# Altium project Digital Interface.PrjPcb (part 1 of 2)
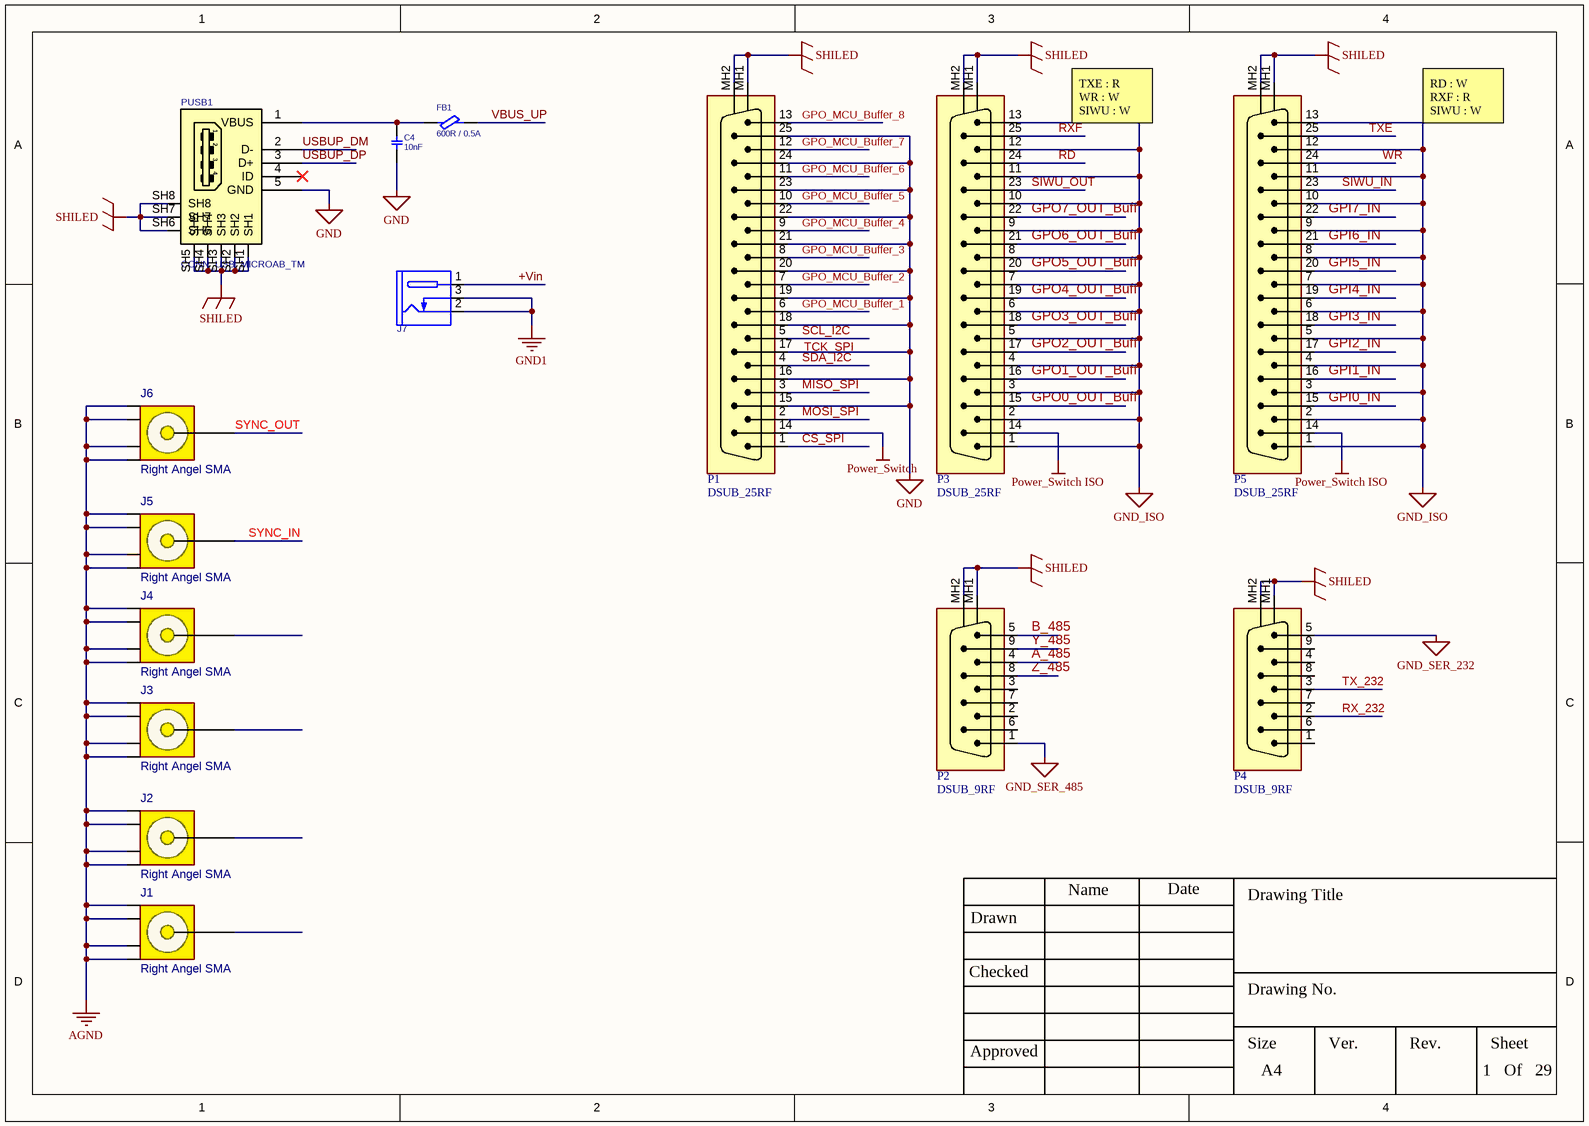
[diagram p0: Terminals.SchDoc]
29 sheets, 393 parts. Net scope: global (net labels, ports and power ports of the same name join across sheets).
Board file: PCB_V0.0.PcbDoc
Sheets:
  Terminals.SchDoc
  Main Power.SchDoc
  AUX Power.SchDoc
  MCU 1.SchDoc
  Analog input.SchDoc
  Analog Output.SchDoc
  USB HUB.SchDoc
  BIT(Built in Test).SchDoc
  Test Points.SchDoc
  RS232.SchDoc
  RS485.SchDoc
  Power Switch.SchDoc
  Display .SchDoc
  Buffers.SchDoc
  Mode Switch.SchDoc
  Level Shifting.SchDoc
  Isolators.SchDoc
  Audio Codec.SchDoc
  SD CARD .SchDoc
  MCU GPIO.SchDoc
  MCU Sup.SchDoc
  Sync In.SchDoc
  Sync Out.SchDoc
  Iso Power Protection.SchDoc
  FT2232HL_IN.SchDoc
  FT2232HL_OUT.SchDoc
  USB_TTL.SchDoc
  On Board Terminals.SchDoc
  screw and Hole.SchDoc

## Sheet Terminals.SchDoc
size 297 x 209 mm; SheetNumber: 1; SheetTotal: 29

### Parts
C4  10nF  [C0603]
FB1  600R / 0.5A  [L0603]
J1  Right Angel SMA  [SMA_RA]
J2  Right Angel SMA  [SMA_RA]
J3  Right Angel SMA  [SMA_RA]
J4  Right Angel SMA  [SMA_RA]
J5  Right Angel SMA  [SMA_RA]
J6  Right Angel SMA  [SMA_RA]
J7  DC_POWER_JACK  [JAC_PWR2]  (value not drawn)
P1  DSUB_25RF  [DSUB_25RF]
P2  DSUB_9RF  [DSUB_9RF]
P3  DSUB_25RF  [DSUB_25RF]
P4  DSUB_9RF  [DSUB_9RF]
P5  DSUB_25RF  [DSUB_25RF]
PUSB1  CONN_USB_MICROAB_TM  [USB_MICRO_AB_TM_SHT]

### Nets
AGND: J1.2(G1) J1.3(G2) J1.4(G3) J1.5(G4) J2.2(G1) J2.3(G2) J2.4(G3) J2.5(G4) J3.2(G1) J3.3(G2) J3.4(G3) J3.5(G4) J4.2(G1) J4.3(G2) J4.4(G3) J4.5(G4) J5.2(G1) J5.3(G2) J5.4(G3) J5.5(G4) J6.2(G1) J6.3(G2) J6.4(G3) J6.5(G4)
GND: C4.1 P1.15 P1.16 P1.17 P1.18 P1.19 P1.20 P1.21 P1.22 P1.23 P1.24 P1.25 PUSB1.5(GND)
GND1: J7.2(SLEEVE) J7.3(INSERTION_DET)
GND_ISO: P3.1 P3.2 P3.3 P3.4 P3.5 P3.6 P3.7 P3.8 P3.9 P3.10 P3.11 P3.12 P3.13 P5.1 P5.2 P5.3 P5.4 P5.5 P5.6 P5.7 P5.8 P5.9 P5.10 P5.11 P5.12 P5.13
GND_SER_232: P4.5
GND_SER_485: P2.1
Power_Switch: P1.14
Power_Switch ISO: P3.14 P5.14
SHILED: P1.MH1 P1.MH2 P2.MH1 P2.MH2 P3.MH1 P3.MH2 P4.MH1 P4.MH2 P5.MH1 P5.MH2 PUSB1.SH1 PUSB1.SH2 PUSB1.SH3 PUSB1.SH4 PUSB1.SH5 PUSB1.SH6 PUSB1.SH7 PUSB1.SH8
+Vin: J7.1(TIP)
A_485: P2.4
B_485: P2.5
CS_SPI: P1.1
GPI0_IN: P5.15
GPI1_IN: P5.16
GPI2_IN: P5.17
GPI3_IN: P5.18
GPI4_IN: P5.19
GPI5_IN: P5.20
GPI6_IN: P5.21
GPI7_IN: P5.22
GPO0_OUT_Buff: P3.15
GPO1_OUT_Buff: P3.16
GPO2_OUT_Buff: P3.17
GPO3_OUT_Buff: P3.18
GPO4_OUT_Buff: P3.19
GPO5_OUT_Buff: P3.20
GPO6_OUT_Buff: P3.21
GPO7_OUT_Buff: P3.22
GPO_MCU_Buffer_1: P1.6
GPO_MCU_Buffer_2: P1.7
GPO_MCU_Buffer_3: P1.8
GPO_MCU_Buffer_4: P1.9
GPO_MCU_Buffer_5: P1.10
GPO_MCU_Buffer_6: P1.11
GPO_MCU_Buffer_7: P1.12
GPO_MCU_Buffer_8: P1.13
MISO_SPI: P1.3
MOSI_SPI: P1.2
~{RD}: P3.24
~{RXF}: P3.25
RX_232: P4.2
SCL_I2C: P1.5  [also labelled TCK_SPI]
SDA_I2C: P1.4
SIWU_IN: P5.23
SIWU_OUT: P3.23
SYNC_IN: J5.1(SIG)  [project net 50_OHM]
SYNC_OUT: J6.1(SIG)
~{TXE}: P5.25
TX_232: P4.3
USBUP_DM: PUSB1.2(D-)
USBUP_DP: PUSB1.3(D+)
VBUS_UP: FB1.2
~{WR}: P5.24
Y_485: P2.9
Z_485: P2.8
NetC4_2: C4.2 FB1.1 PUSB1.1(VBUS)

Not connected (* = marked no-connect by the designer): J1 1(SIG); J2 1(SIG); J3 1(SIG); J4 1(SIG); P2 2 3 6 7; P4 1 4 6 7 8 9; PUSB1 4(ID)*

### Notes on the sheet
- TXE : R
  WR : W
  SIWU : W
- RD : W
  RXF : R
  SIWU : W
- Drawn
- Name
- Date
- Drawing Title
- Checked
- Drawing No.
- Approved
- Size
- A4
- Ver.
- Rev.
- Sheet
- Of

### Library data of the parts
C4 = CAP_SMD_MLCC_10u16V: CAP, MLCC, X5R, 10uF, 10%, 16V, 0603; MANF_P#: GRT188R61C106KE13D; MANF: Murata; PARAM: X5R, 10%, -55~85°C; PARAM2: 16V; PRICE: 100= 20$; VALUE: 10nF
FB1 = FBEAD_SMD_MPZ1608S102: FERRITE_Bead, 0603, 0.8A, 300mOhm, 1000@100MHz; MANF: TDK; MANF_P#: MPZ1608S102ATA00; PARAM: 1000@100MHz; PARAM2: 0.8A; PRICE: 100= 3.4$; VALUE: 600R / 0.5A
J1-J6 = CONN_RF_SMA_RA: CONN, RF, SMA, Right Angle; MANF_P#: SMA-J-P-H-RA-TH1; MANF: Samtec; PARAM: 50Ohm, 20GHz; DESC: DESCRIPTION; DIST#: DIGIKEY; PARAM2: GOLD; ASSEMBLY: ASSEMBLY; PRICE: 6.3$; VALUE: Right Angel SMA
J7 = CONN_PWR_JACKR2: CONN, PWR JACK DC, PLUG DIAM 2.0MM RA THD; MANF: CUI STACK; MANF_P#: PJ-202A, PJ-002AH, PJ-102AH, KLDX-0202; VALUE: DC_POWER_JACK
P1 P3 P5 = CONN_DSUB_25RF: CONN, DSUB, HD, 25PIN, R/A, FEMALE, THD; MANF_P#: -; MANF: -; VALUE: DSUB_25RF
P2 P4 = CONN_DSUB_9RF: CONN, DSUB, HD, 9PIN, R/A, FEMALE, THD; MANF_P#: -; MANF: -; VALUE: DSUB_9RF
PUSB1 = CONN_USB_MICRO_AB_TM_SHT: CONN, USB, MICRO AB, R/A, SMD, TOP MOUNT; MANF_P#: 47590-0001; MANF: MOLEX; PARAM2: 30VAC; PARAM: 1.8A, -20~85oC; PRICE: 0.75$; VALUE: CONN_USB_MICROAB_TM

## Sheet Main Power.SchDoc
size 297 x 209 mm; SheetNumber: 2; SheetTotal: 29
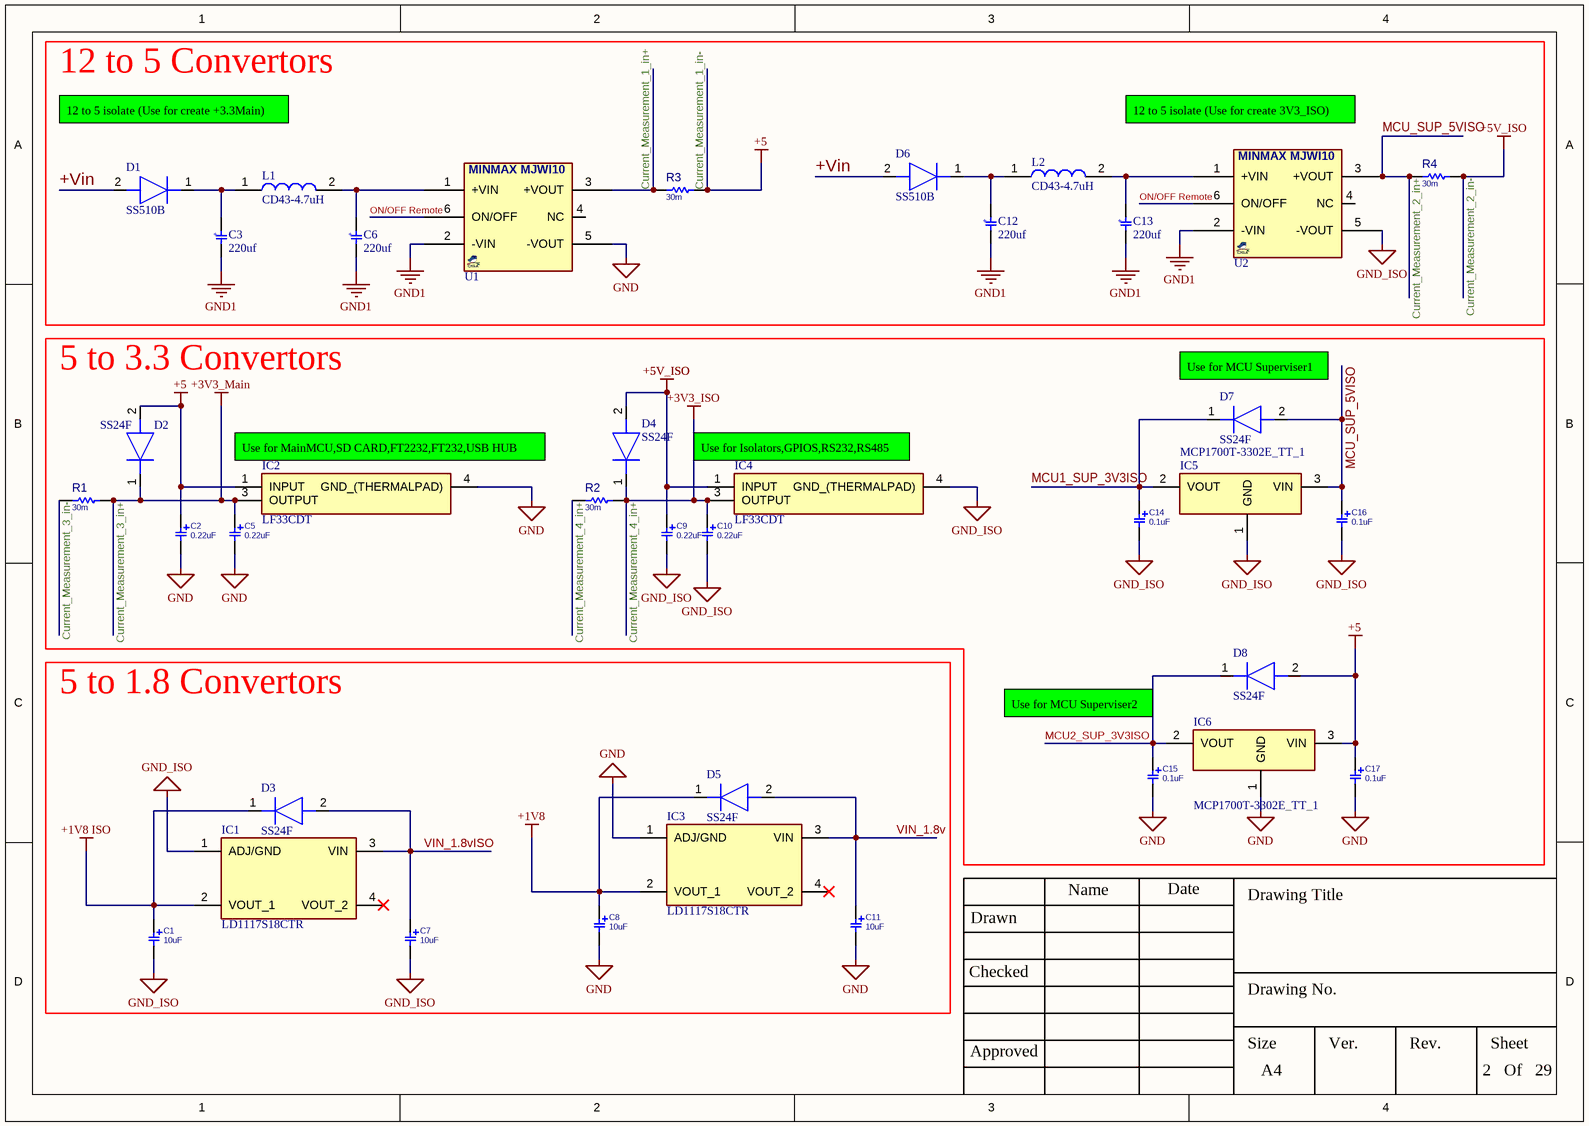
[diagram p1: Main Power.SchDoc]

### Parts
C1  10uF  [C_TN_3528]
C2  0.22uF  [C_TN_3528]
C3  value 220uf  [Cap_D]  (hidden comment: Capacitor Tantalum SMD)
C5  0.22uF  [C_TN_3528]
C6  value 220uf  [Cap_D]  (hidden comment: Capacitor Tantalum SMD)
C7  10uF  [C_TN_3528]
C8  10uF  [C_TN_3528]
C9  0.22uF  [C_TN_3528]
C10  0.22uF  [C_TN_3528]
C11  10uF  [C_TN_3528]
C12  value 220uf  [Cap_D]  (hidden comment: Capacitor Tantalum SMD)
C13  value 220uf  [Cap_D]  (hidden comment: Capacitor Tantalum SMD)
C14  0.1uF  [C_TN_3528]
C15  0.1uF  [C_TN_3528]
C16  0.1uF  [C_TN_3528]
C17  0.1uF  [C_TN_3528]
D1  SS510B  [DIOM5336X244N]
D2  SS24F  [SODFL4626X110N]
D3  SS24F  [SODFL4626X110N]
D4  SS24F  [SODFL4626X110N]
D5  SS24F  [SODFL4626X110N]
D6  SS510B  [DIOM5336X244N]
D7  SS24F  [SODFL4626X110N]
D8  SS24F  [SODFL4626X110N]
IC1  LD1117S18CTR  [SOT230P700X180-4N]
IC2  LF33CDT  [TO228P972X240-3N]
IC3  LD1117S18CTR  [SOT230P700X180-4N]
IC4  LF33CDT  [TO228P972X240-3N]
IC5  MCP1700T-3302E_TT_1  [SOT95P237X112-3N]
IC6  MCP1700T-3302E_TT_1  [SOT95P237X112-3N]
L1  CD43-4.7uH  [CD43NP220MC]
L2  CD43-4.7uH  [CD43NP220MC]
R1  30m  [R2512]
R2  30m  [R2512]
R3  30m  [R2512]
R4  30m  [R2512]
U1  MJWI10-24S05  [MINMAX_MJWI10]  (value not drawn)
U2  MJWI10-24S05  [MINMAX_MJWI10]  (value not drawn)

### Blocks framed on the sheet
12 to 5 Convertors: C3 C6 C12 C13 D1 D6 L1 L2 R3 R4 U1 U2
5 to 3.3 Convertors: C2 C5 C9 C10 C14-C17 D2 D4 D7 D8 IC2 IC4-IC6 R1 R2
5 to 1.8 Convertors: C1 C7 C8 C11 D3 D5 IC1 IC3

### Nets
+1V8: C8.1 D5.1(K) IC3.2(VOUT_1)  [project net Audio_VDD_1V8]
+1V8 ISO: C1.1 D3.1(K) IC1.2(VOUT_1)
+3V3_Main: C5.1 D2.1(K) IC2.3(OUTPUT) R1.2  [also labelled Current_Measurement_3_in+]  [project net Audio_VDD_3V3]
Current_Measurement_1_in-: C2.1 C17.1 D2.2(A) D8.2(A) IC2.1(INPUT) IC6.3(VIN) R3.2  [also labelled +5]
Current_Measurement_2_in-: C9.1 D4.2(A) IC4.1(INPUT) R4.2  [also labelled +5V_ISO]
Current_Measurement_4_in+: C10.1 D4.1(K) IC4.3(OUTPUT) R2.1 R2.2  [also labelled +3V3_ISO]
GND: C2.2 C5.2 C8.2 C11.2 C15.2 C17.2 IC2.4(GND_(THERMALPAD)) IC3.1(ADJ/GND) IC6.1(GND) U1.5(-VOUT)
GND1: C3.1 C6.1 C12.1 C13.1 U1.2(-VIN) U2.2(-VIN)
GND_ISO: C1.2 C7.2 C9.2 C10.2 C14.2 C16.2 IC1.1(ADJ/GND) IC4.4(GND_(THERMALPAD)) IC5.1(GND) U2.5(-VOUT)
MCU2_SUP_3V3ISO: C15.1 D8.1(K) IC6.2(VOUT)
+Vin: D1.2(A) D6.2(A)
Current_Measurement_1_in+: R3.1 U1.3(+VOUT)
Current_Measurement_2_in+: C16.1 D7.2(A) IC5.3(VIN) R4.1 U2.3(+VOUT)  [also labelled MCU_SUP_5VISO]
Current_Measurement_3_in-: R1.1
MCU1_SUP_3V3ISO: C14.1 D7.1(K) IC5.2(VOUT)
ON/OFF Remote: U1.6(ON/OFF) U2.6(ON/OFF)
VIN_1.8v: C11.1 D5.2(A) IC3.3(VIN)
VIN_1.8vISO: C7.1 D3.2(A) IC1.3(VIN)
NetC3_2: C3.2 D1.1(K) L1.1
NetC6_2: C6.2 L1.2 U1.1(+VIN)
NetC12_2: C12.2 D6.1(K) L2.1
NetC13_2: C13.2 L2.2 U2.1(+VIN)

Not connected (* = marked no-connect by the designer): IC1 4(VOUT_2)*; IC3 4(VOUT_2)*; U1 4(NC); U2 4(NC)

### Notes on the sheet
- 12 to 5 isolate (Use for create +3.3Main)
- 12 to 5 isolate (Use for create 3V3_ISO)
- (near D7) Use for MCU Superviser1
- (near IC2) Use for MainMCU,SD CARD,FT2232,FT232,USB HUB
- (near IC4) Use for Isolators,GPIOS,RS232,RS485
- Use for MCU Superviser2
- Drawn
- Name
- Date
- Drawing Title
- Checked
- Drawing No.
- Approved
- Size
- A4
- Ver.
- Rev.
- Sheet
- Of
- (in symbol Capacitor Tantalum SMD) +
- (in symbol MJWI10-24S05) MINMAX MJWI10

### Library data of the parts
C1 C2 C5 C7-C11 C14-C17 = CAP_SMD_TAN: CAP, SMD, TAN,; PARAM2: -V
  C1 C7 C8 C11: VALUE: 10uF
  C2 C5 C9 C10: VALUE: 0.22uF
  C14-C17: VALUE: 0.1uF
D1 D6 = SS510B: Diode; Manufacturer_Name: HY Electronic; Height: 2.44mm; Manufacturer_Part_Number: SS510B
D2-D5 D7 D8 = SS24F: Diode; Manufacturer_Name: Shikues; Datasheet Link: https://eastronic88.en.made-in-china.com/print/FZStilOdyghn/China-Schottky-Barrier-Rectifier-Diode-SS24F-2-0A-40V-SMAF.html; Height: 1.1mm; Manufacturer_Part_Number: SS24F
IC1 IC3 = LD1117S18CTR: Integrated Circuit; Manufacturer_Name: STMicroelectronics; Datasheet Link: http://www.st.com/st-web-ui/static/active/en/resource/technical/document/datasheet/CD00000544.pdf; Height: 1.8mm; Manufacturer_Part_Number: LD1117S18CTR; Mouser Part Number: 511-LD1117S18CTR; Mouser Price/Stock: https://www.mouser.co.uk/ProductDetail/STMicroelectronics/LD1117S18CTR?qs=qolwYojYp3Sa3BPkKnJupg%3D%3D; Arrow Part Number: LD1117S18CTR; Arrow Price/Stock: https://www.arrow.com/en/products/ld1117s18ctr/stmicroelectronics?region=nac
IC2 IC4 = LF33CDT: Integrated Circuit; Manufacturer_Name: STMicroelectronics; Datasheet Link: http://www.st.com/web/en/resource/technical/document/datasheet/CD00000546.pdf; Height: 2.4mm; Manufacturer_Part_Number: LF33CDT; Mouser Part Number: 511-LF33CDT; Mouser Price/Stock: https://www.mouser.co.uk/ProductDetail/STMicroelectronics/LF33CDT?qs=tZUCD5p2VWo1sRQNOfAbrg%3D%3D
IC5 IC6 = MCP1700T-3302E_TT_1: Integrated Circuit; Manufacturer_Name: Microchip; Manufacturer_Part_Number: MCP1700T-3302E/TT; Datasheet Link: https://datasheet.datasheetarchive.com/originals/distributors/SFDatasheet-4/sf-00090030.pdf; Height: 1.12mm; Mouser Part Number: 579-MCP1700T3302E/TT; Mouser Price/Stock: https://www.mouser.co.uk/ProductDetail/Microchip-Technology/MCP1700T-3302E-TT?qs=fM4xO01eazPmCNDrdHEdaw%3D%3D; Arrow Part Number: MCP1700T-3302E/TT; Arrow Price/Stock: https://www.arrow.com/en/products/mcp1700t-3302ett/microchip-technology?region=europe
L1 L2 = CD43NP-220MC: Inductor; Manufacturer_Name: Sumida; Datasheet Link: https://products.sumida.com/products/pdf/CD43.pdf; Height: 3.5mm; Manufacturer_Part_Number: CD43NP-220MC; Mouser Part Number: 851-CD43NP-220MC; Mouser Price/Stock: https://www.mouser.co.uk/ProductDetail/Sumida/CD43NP-220MC?qs=ttApTud31JYLH5yY3TuJPg%3D%3D; Arrow Part Number: CD43NP-220MC; Arrow Price/Stock: https://www.arrow.com/en/products/cd43np-220mc/sumida?region=nac
R1-R4 = RES_SMD_2512: RESISTOR, SMD; PARAM: -W; DESC: DESCRIPTION; DIST#: MOUSER; PARAM2: 1%; MANF_P#: -; MANF: -; ASSEMBLY: ASSEMBLY; PRICE: 100= 0.5$; VALUE: 30m
U1 U2 = MJWI10-24S05: DC-DC Converter, Isolated, 10W; MANF: MINMAX; PARAM2: 9~36(24)Vin, 5Vout, 10W; PARAM: 2000mA, -40~80°C; DESC: https://www.minmax.com.tw/en/download/files/546/MJWI10_Datasheet.pdf; MANF_P#: MJWI10-24S05; VALUE: MJWI10-24S05
C3 C6 C12 C13 = Capacitor Tantalum SMD: DatasheetVersion: 2021; ComponentLink1Description: Website Smart World; ComponentLink1URL: https://www.smartw.ir/; ComponentLink2Description: Telegram; ComponentLink2URL: https://t.me/altium_smartw; ComponentLink3Description: Instagram; ComponentLink3URL: https://Instagram.com/smartgw.ir

## Sheet AUX Power.SchDoc
size 297 x 209 mm; SheetNumber: 3; SheetTotal: 29
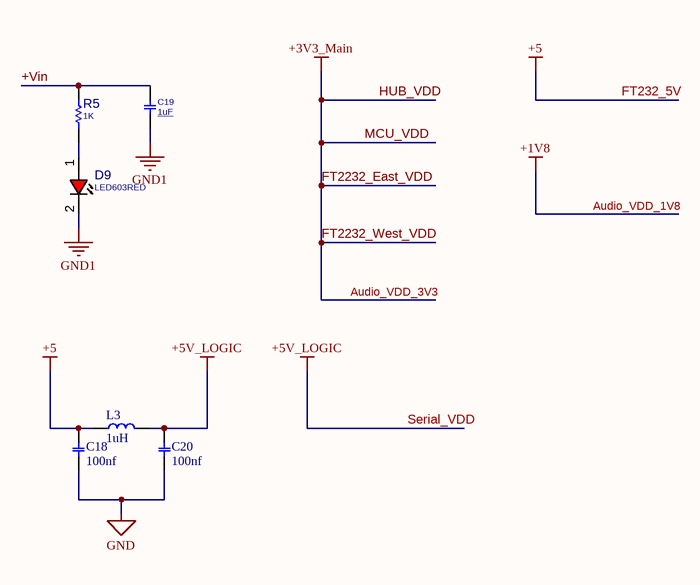
[diagram p2: AUX Power.SchDoc]

### Parts
C18  value 100nf  [C1206]  (hidden comment: Capacitor C SMD 1206)
C19  1uF  [0603]
C20  value 100nf  [C1206]  (hidden comment: Capacitor C SMD 1206)
D9  LED603RED  [LED0603RED]
L3  value 1uH  [L1812]  (hidden comment: Inductor SMD NC 1812)
R5  1K  [R0603]

### Nets
+5: C18.2 L3.1  [also labelled FT232_5V]  [project net Current_Measurement_1_in-]
GND: C18.1 C20.1
GND1: C19.2 D9.2(CATHODE)
Serial_VDD: C20.2 L3.2  [also labelled +5V_LOGIC]
+Vin: C19.1 R5.2
NetD9_1: D9.1(ANODE) R5.1

### Notes on the sheet
- Drawn
- Name
- Date
- Drawing Title
- Checked
- Drawing No.
- Approved
- Size
- A4
- Ver.
- Rev.
- Sheet
- Of

### Library data of the parts
C19 = CAP_SMD_FILM_1u16v_1210: CAP, FILM, 1uF, 16V, Acryl, 20%, 1210; PARAM: Acrylic, MetallizedStacked, 20%, -40~85oC; MANF_P#: ECP-U1C105MA5; MANF: Panasonic; PRICE: 100= 36$; DESC: -; PARAM2: 16V; ASSEMBLY: ASSEMBLY; VALUE: 1uF
D9 = LED_SMD_0603_RED: LED, SMD, 0603, RED; PARAM: 30mA, 640nm; DESC: DESCRIPTION; MANF_P#: MANF_PART#; PARAM2: 1.8~2.5V; MANF: MANF; ASSEMBLY: ASSEMBLY; PRICE: PRICE; VALUE: LED603RED
R5 = RES_SMD_0603: RESISTOR, SMD; PARAM: -W; DESC: DESCRIPTION; DIST#: MOUSER; PARAM2: 1%; MANF_P#: -; MANF: -; ASSEMBLY: ASSEMBLY; PRICE: 100= 0.5$; VALUE: 1K
C18 C20 = Capacitor C SMD 1206: DatasheetVersion: 2021; ComponentLink1Description: Website Smart World; ComponentLink1URL: https://www.smartw.ir/; ComponentLink2Description: Telegram; ComponentLink2URL: https://t.me/altium_smartw; ComponentLink3Description: Instagram; ComponentLink3URL: https://Instagram.com/smartgw.ir
L3 = Inductor SMD NC 1812: DatasheetVersion: 2021; ComponentLink1Description: Website Smart World; ComponentLink1URL: https://www.smartw.ir/; ComponentLink2Description: Telegram; ComponentLink2URL: https://t.me/altium_smartw; ComponentLink3Description: Instagram; ComponentLink3URL: https://Instagram.com/smartgw.ir

## Sheet MCU 1.SchDoc
size 297 x 209 mm; SheetNumber: 4; SheetTotal: 29
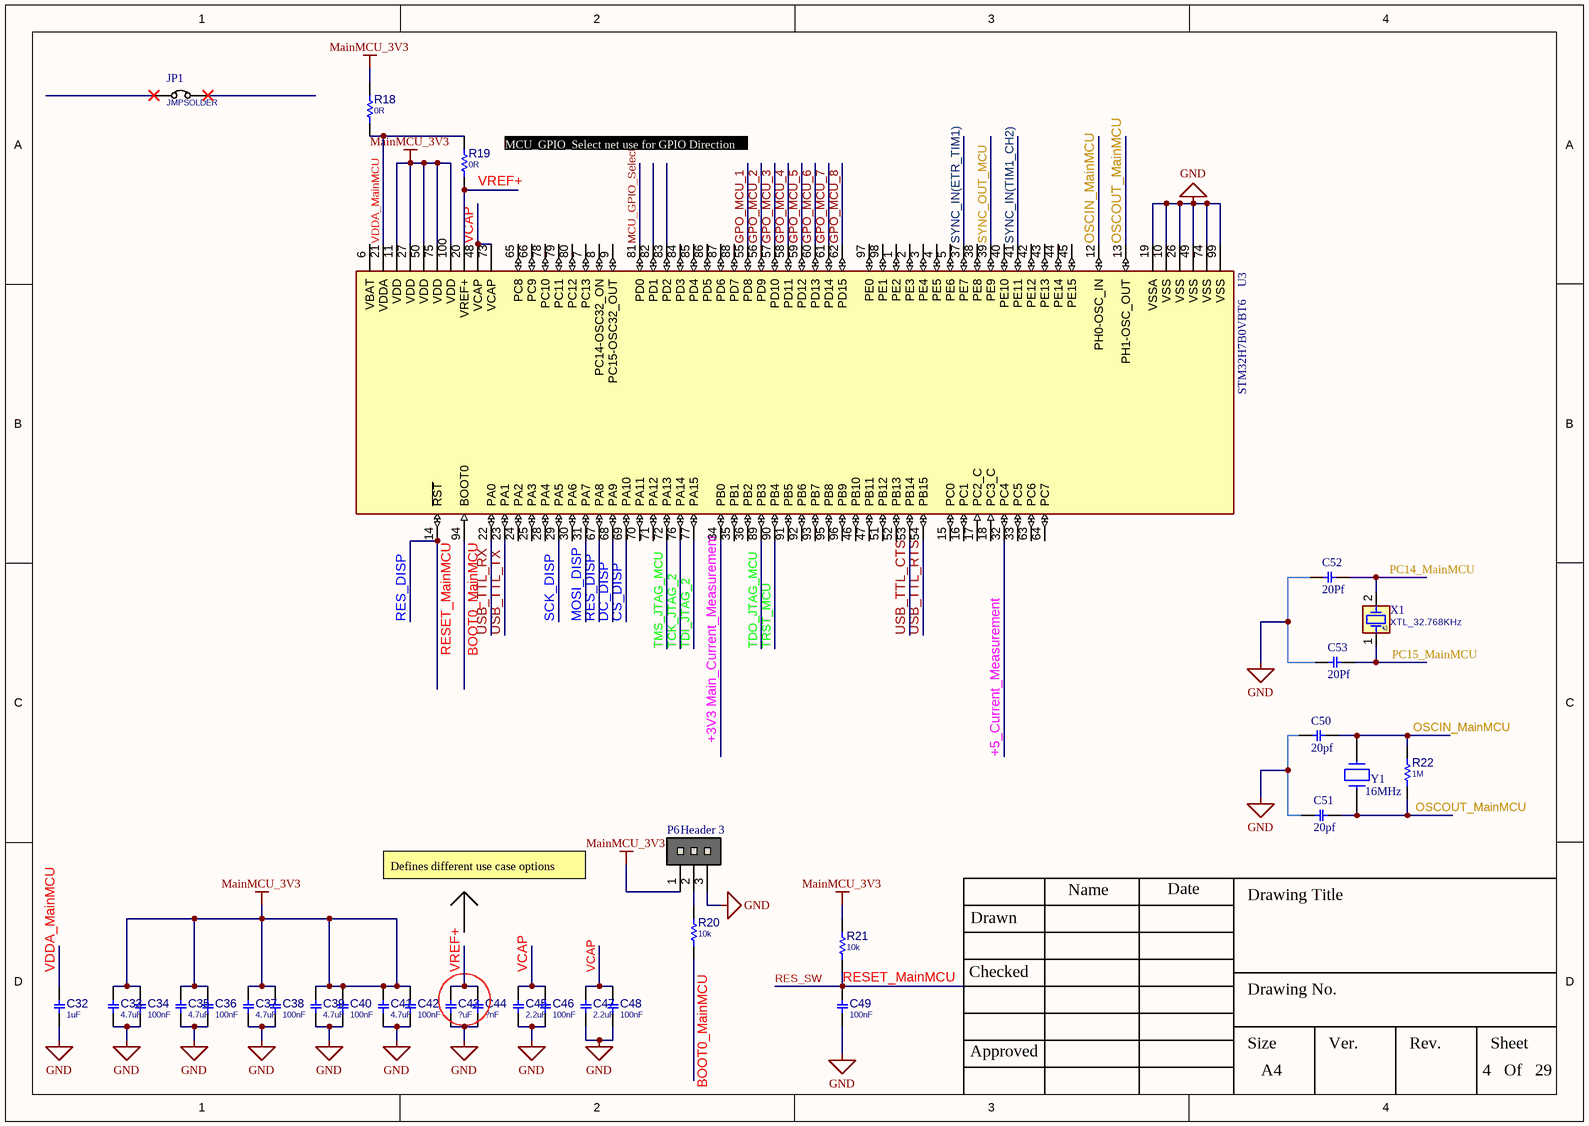
[diagram p3: MCU 1.SchDoc]

### Parts
C32  1uF  [C0805]
C33  4.7uF  [C0805]
C34  100nF  [C0603]
C35  4.7uF  [C0805]
C36  100nF  [C0603]
C37  4.7uF  [C0805]
C38  100nF  [C0603]
C39  4.7uF  [C0805]
C40  100nF  [C0603]
C41  4.7uF  [C0805]
C42  100nF  [C0603]
C43  ?uF  [C0805]
C44  ?nF  [C0603]
C45  2.2uF  [C0805]
C46  100nF  [C0603]
C47  2.2uF  [C0805]
C48  100nF  [C0603]
C49  100nF  [C0603]
C50  value 20pf  [C0603]  (hidden comment: Capacitor C SMD 0603)
C51  value 20pf  [C0603]  (hidden comment: Capacitor C SMD 0603)
C52  value 20Pf  [C0603]  (hidden comment: Capacitor C SMD 0603)
C53  value 20Pf  [C0603]  (hidden comment: Capacitor C SMD 0603)
JP1  JMPSOLDER  [JP_40X50]
P6  Header 3  [HDR 1X3]
R18  0R  [R0603]
R19  0R  [R0603]
R20  10k  [R0603]
R21  10k  [R0603]
R22  1M  [R0603]
U3  STM32H7B0VBT6  [QFP50P1600X1600X160-100N]
X1  XTL_32.768KHz  [XTL_2_2012]
Y1  16MHz  [XTL_2_11X5]

### Nets
GND: C32.2 C33.2 C34.2 C35.2 C36.2 C37.2 C38.2 C39.2 C40.2 C41.2 C42.2 C43.2 C44.2 C45.2 C46.2 C47.2 C48.2 C49.2 C50.1 C51.1 C52.1 C53.1 P6.3 U3.10(VSS) U3.19(VSSA) U3.26(VSS) U3.49(VSS) U3.74(VSS) U3.99(VSS)
MainMCU_3V3: C33.1 C34.1 C35.1 C36.1 C37.1 C38.1 C39.1 C40.1 C41.1 C42.1 P6.1 R18.2 R21.2 U3.11(VDD) U3.27(VDD) U3.50(VDD) U3.75(VDD) U3.100(VDD)
+3V3 Main_Current_Measurement: U3.34(PB0)
+5_Current_Measurement: U3.32(PC4)
BOOT0_MainMCU: R20.1 U3.94(BOOT0)
CS_DISP: U3.69(PA10)
DC_DISP: U3.68(PA9)
GPO_MCU_1: U3.55(PD8)
GPO_MCU_2: U3.56(PD9)
GPO_MCU_3: U3.57(PD10)
GPO_MCU_4: U3.58(PD11)
GPO_MCU_5: U3.59(PD12)
GPO_MCU_6: U3.60(PD13)
GPO_MCU_7: U3.61(PD14)
GPO_MCU_8: U3.62(PD15)
MCU_GPIO_Select: U3.81(PD0)
MOSI_DISP: U3.31(PA7)
OSCIN_MainMCU: C50.2 R22.2 U3.12(PH0-OSC_IN) Y1.2
OSCOUT_MainMCU: C51.2 R22.1 U3.13(PH1-OSC_OUT) Y1.1
PC14_MainMCU: C52.2 X1.2(OSC2)
PC15_MainMCU: C53.2 X1.1(OSC1)
RES_DISP: C49.1 R21.1 U3.14(~{RST}) U3.67(PA8)  [also labelled RES_SW, RESET_MainMCU]
SCK_DISP: U3.29(PA5)
SYNC_IN(ETR_TIM1): U3.37(PE7)
SYNC_IN(TIM1_CH2): U3.41(PE11)
SYNC_OUT_MCU: U3.39(PE9)
~{TRST}_MCU: U3.90(PB4)
TCK_JTAG_2: U3.76(PA14)
TDI_JTAG_2: U3.77(PA15)
TDO_JTAG_MCU: U3.89(PB3)
TMS_JTAG_MCU: U3.72(PA13)
USB_TTL_CTS: U3.53(PB14)
USB_TTL_RTS: U3.54(PB15)
USB_TTL_RX: U3.22(PA0)
USB_TTL_TX: U3.23(PA1)
VCAP: C45.1 C46.1 C47.1 C48.1 U3.48(VCAP) U3.73(VCAP)
VDDA_MainMCU: C32.1 R18.1 R19.2 U3.21(VDDA)
VREF+: C43.1 C44.1 R19.1 U3.20(VREF+)
NetP6_2: P6.2 R20.2

Not connected (* = marked no-connect by the designer): JP1 1* 2*; U3 1(PE2) 2(PE3) 3(PE4) 4(PE5) 5(PE6) 6(VBAT) 7(PC13) 8(PC14-OSC32_ON) 9(PC15-OSC32_OUT) 15(PC0) 16(PC1) 17(PC2_C) 18(PC3_C) 24(PA2) 25(PA3) 28(PA4) 30(PA6) 33(PC5) 35(PB1) 36(PB2) 38(PE8) 40(PE10) 42(PE12) 43(PE13) 44(PE14) 45(PE15) 46(PB10) 47(PB11) 51(PB12) 52(PB13) 63(PC6) 64(PC7) 65(PC8) 66(PC9) 70(PA11) 71(PA12) 78(PC10) 79(PC11) 80(PC12) 82(PD1) 83(PD2) 84(PD3) 85(PD4) 86(PD5) 87(PD6) 88(PD7) 91(PB5) 92(PB6) 93(PB7) 95(PB8) 96(PB9) 97(PE0) 98(PE1)

### Notes on the sheet
- (near R19) MCU_GPIO_Select net use for GPIO Direction
- Defines different use case options
- Drawn
- Name
- Date
- Drawing Title
- Checked
- Drawing No.
- Approved
- Size
- A4
- Ver.
- Rev.
- Sheet
- Of

### Library data of the parts
C32 C33 C35 C37 C39 C41 C43 C45 C47 = CAP_SMD_MLCC_2.2u50V_0805: CAP, MLCC; MANF_P#: UMK212ABJ225KG-T; MANF: Taiyo Yuden; PARAM: X5R, 10%; DIST#: MOUSER; PARAM2: 50V; ASSEMBLY: ASSEMBLY; PRICE: 100= 10$; DESC: CAP, MLCC
  C32: VALUE: 1uF
  C33 C35 C37 C39 C41: VALUE: 4.7uF
  C43: VALUE: ?uF
  C45 C47: VALUE: 2.2uF
C34 C36 C38 C40 C42 C44 C46 C48 C49 = CAP_SMD_MLCC_2.2u50V_0603: CAP, MLCC; MANF_P#: C1005X7R1H104K050BB; MANF: TDK; PARAM: X7R, 10%; DIST#: MOUSER; PARAM2: 50V; ASSEMBLY: ASSEMBLY; PRICE: 1000= 27$; DESC: CAP, MLCC
  C34 C36 C38 C40 C42 C46 C48 C49: VALUE: 100nF
  C44: VALUE: ?nF
JP1 = JUMPER_SOLDER: JUMPER, HEADER 2PIN; MANF: MANF; MANF_P#: MANF_P#; VALUE: JMPSOLDER
P6 = Header 3: Header, 3-Pin; ComponentLinkp-URL: https://www.smartw.ir/; DatasheetVersion: 2020
R18-R21 = RES_SMD_0603: as R5 on sheet AUX Power; MANF_P#: -; MANF: -; ASSEMBLY: ASSEMBLY; PRICE: 100= 0.5$
  R18 R19: VALUE: 0R
  R20 R21: VALUE: 10k
R22 = RES_SMD: RESISTOR, SMD; PARAM: -W; DESC: DESCRIPTION; DIST#: MOUSER; PARAM2: 1%; MANF_P#: -; MANF: -; ASSEMBLY: ASSEMBLY; PRICE: 100= 0.5$; VALUE: 1M
U3 = STM32H7B0VBT6: ARMÂ® CortexÂ®-M7 STM32H7 Microcontroller IC 32-Bit Single-Core 280MHz 128KB (128K x 8) FLASH 100-LQFP (14x14); MF: STMicroelectronics; Availability: In Stock; Purchase-URL: https://pricing.snapeda.com/search/part/STM32H7B0VBT6/?ref=eda; SnapEDA_Link: https://www.snapeda.com/parts/STM32H7B0VBT6/STMicroelectronics/view-part/?ref=snap; MP: STM32H7B0VBT6; Price: None; Value: *; Check_prices: https://www.snapeda.com/parts/STM32H7B0VBT6/STMicroelectronics/view-part/?ref=eda; Package: LQFP-100 STMicroelectronics
X1 = XTL_2_32.768_2012EP: Crystal, 32.768KHz, 12pF, 20PPM; MANF: EPSON; MANF_P#: FC-12M 32.7680KA-A3; PARAM: -40~85oC; PARAM2: 12pF, 20PPM; PRICE: 0.8$; VALUE: XTL_32.768KHz
Y1 = Crystal: ComponentLink1Description: Website Smart World; ComponentLink1URL: https://www.smartw.ir/; ComponentLink2Description: Telegram; ComponentLink2URL: https://t.me/altium_smartw; ComponentLink3Description: Instagram; ComponentLink3URL: https://Instagram.com/smartgw.ir; DatasheetVersion: 2021
C50-C53 = Capacitor C SMD 0603: DatasheetVersion: 2021; ComponentLink1Description: Website Smart World; ComponentLink1URL: https://www.smartw.ir/; ComponentLink2Description: Telegram; ComponentLink2URL: https://t.me/altium_smartw; ComponentLink3Description: Instagram; ComponentLink3URL: https://Instagram.com/smartgw.ir

## Sheet Analog input.SchDoc
size 297 x 209 mm; SheetNumber: 6; SheetTotal: 32

### Notes on the sheet
- Drawn
- Name
- Date
- Drawing Title
- Checked
- Drawing No.
- Approved
- Size
- A4
- Ver.
- Rev.
- Sheet
- Of

## Sheet Analog Output.SchDoc
size 297 x 209 mm; SheetNumber: 7; SheetTotal: 32

### Notes on the sheet
- Drawn
- Name
- Date
- Drawing Title
- Checked
- Drawing No.
- Approved
- Size
- A4
- Ver.
- Rev.
- Sheet
- Of

## Sheet USB HUB.SchDoc
size 297 x 209 mm; SheetNumber: 7; SheetTotal: 29
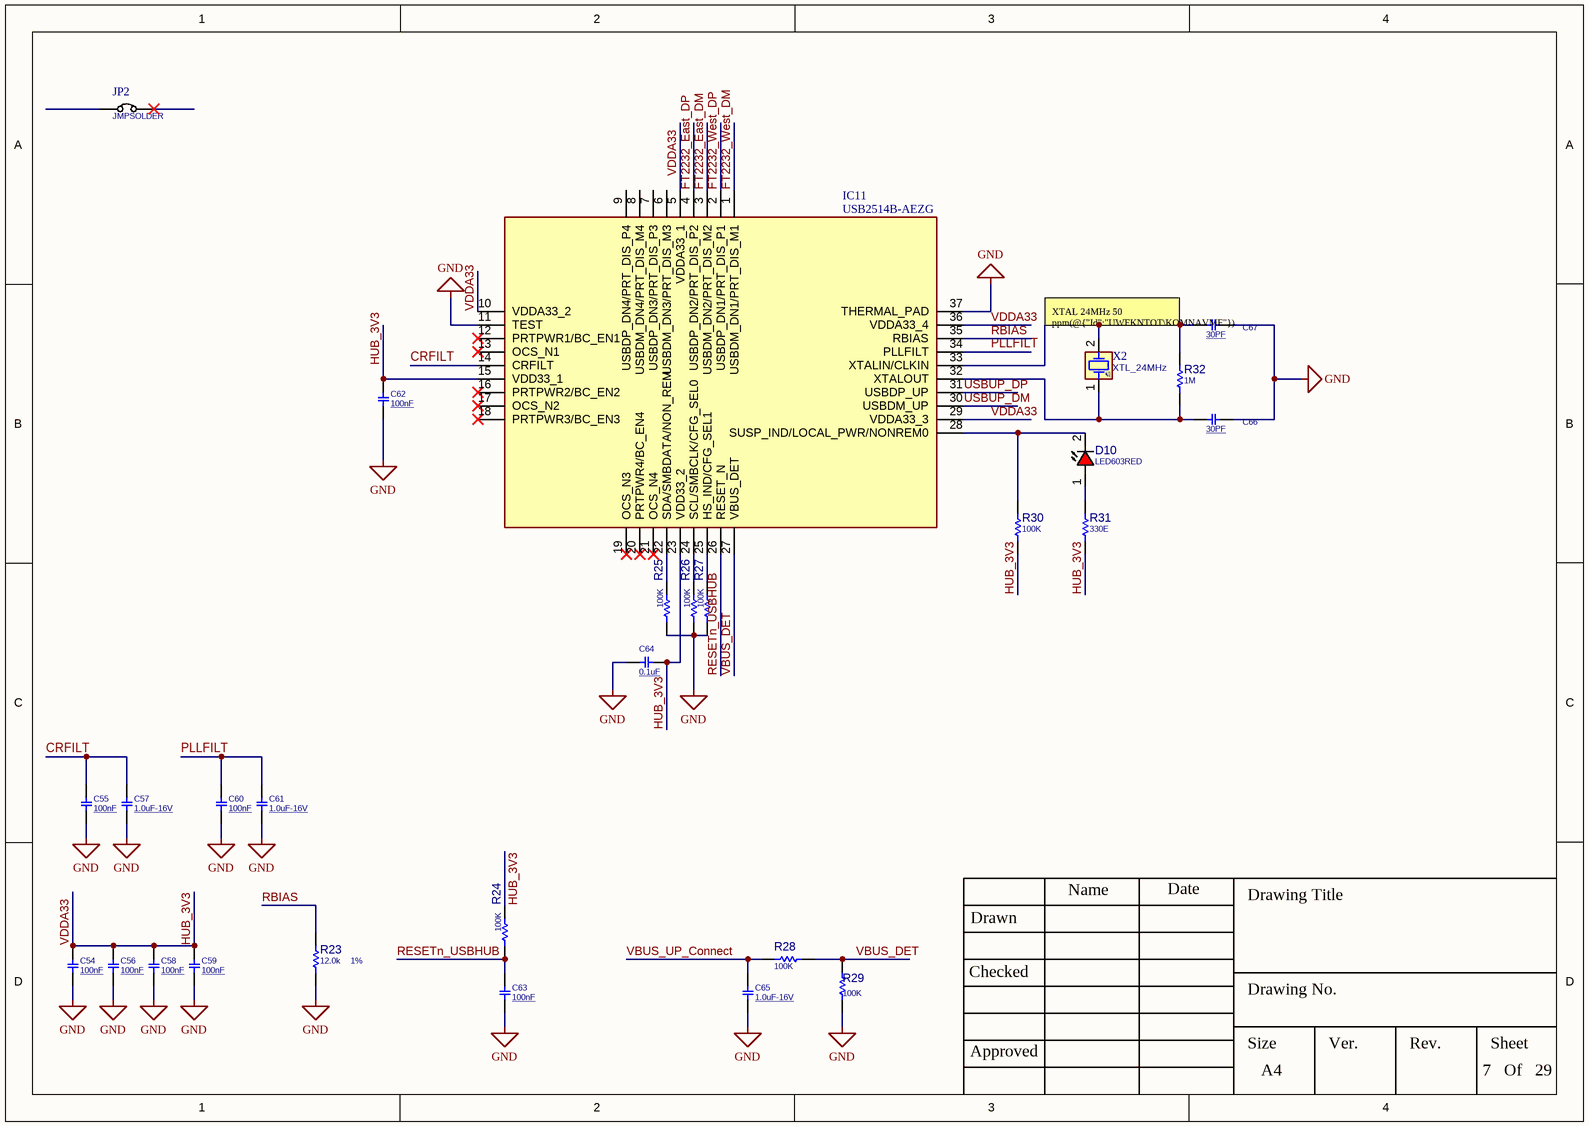
[diagram p4: USB HUB.SchDoc]

### Parts
C54  100nF  [0603]
C55  100nF  [0603]
C56  100nF  [0603]
C57  1.0uF-16V  [0603]
C58  100nF  [0603]
C59  100nF  [0603]
C60  100nF  [0603]
C61  1.0uF-16V  [0603]
C62  100nF  [0603]
C63  100nF  [0603]
C64  0.1uF  [0603]
C65  1.0uF-16V  [0603]
C66  30PF  [C0805]
C67  30PF  [C0805]
D10  LED603RED  [LED0603RED]
IC11  USB2514B-AEZG  [QFN50P600X600X100-37N-D]
JP2  JMPSOLDER  [JP_40X50]
R23  12.0k    1%  [R0603]
R24  100K  [R0603]
R25  100K  [R0603]
R26  100K  [R0603]
R27  100K  [R0603]
R28  100K  [R0603]
R29  100K  [R0603]
R30  100K  [R0603]
R31  330E  [R0603]
R32  1M  [R0603]
X2  XTL_24MHz  [XTL_2_11X5]

### Nets
GND: C54.1 C55.2 C56.1 C57.2 C58.1 C59.1 C60.2 C61.2 C62.1 C63.2 C64.2 C65.2 C66.2 C67.2 IC11.11(TEST) IC11.37(THERMAL_PAD) R23.1 R25.1 R26.1 R27.1 R29.1
CRFILT: C55.1 C57.1 IC11.14(CRFILT)
FT2232_East_DM: IC11.3(USBDM_DN2/PRT_DIS_M2)
FT2232_East_DP: IC11.4(USBDP_DN2/PRT_DIS_P2)
FT2232_West_DM: IC11.1(USBDM_DN1/PRT_DIS_M1)
FT2232_West_DP: IC11.2(USBDP_DN1/PRT_DIS_P1)
HUB_3V3: C54.2 C56.2 C58.2 C59.2 C62.2 C64.1 IC11.5(VDDA33_1) IC11.10(VDDA33_2) IC11.15(VDD33_1) IC11.23(VDD33_2) IC11.29(VDDA33_3) IC11.36(VDDA33_4) R24.2 R30.1 R31.1  [also labelled VDDA33]
PLLFILT: C60.1 C61.1 IC11.34(PLLFILT)
RBIAS: IC11.35(RBIAS) R23.2
RESETn_USBHUB: C63.1 IC11.26(RESET_N) R24.1
USBUP_DM: IC11.30(USBDM_UP)
USBUP_DP: IC11.31(USBDP_UP)
VBUS_DET: IC11.27(VBUS_DET) R28.2 R29.2
VBUS_UP_Connect: C65.1 R28.1
NetC66_1: C66.1 IC11.32(XTALOUT) R32.1 X2.1(OSC1)
NetC67_1: C67.1 IC11.33(XTALIN/CLKIN) R32.2 X2.2(OSC2)
NetD10_1: D10.1(ANODE) R31.2
NetD10_2: D10.2(CATHODE) IC11.28(SUSP_IND/LOCAL_PWR/NONREM0) R30.2
NetIC11_22: IC11.22(SDA/SMBDATA/NON_REM) R25.2
NetIC11_24: IC11.24(SCL/SMBCLK/CFG_SEL0) R26.2
NetIC11_25: IC11.25(HS_IND/CFG_SEL1) R27.2

Not connected (* = marked no-connect by the designer): IC11 6(USBDM_DN3/PRT_DIS_M3) 7(USBDP_DN3/PRT_DIS_P3) 8(USBDM_DN4/PRT_DIS_M4) 9(USBDP_DN4/PRT_DIS_P4) 12(PRTPWR1/BC_EN1)* 13(OCS_N1)* 16(PRTPWR2/BC_EN2)* 17(OCS_N2)* 18(PRTPWR3/BC_EN3)* 19(OCS_N3)* 20(PRTPWR4/BC_EN4)* 21(OCS_N4)*; JP2 1 2*

### Notes on the sheet
- XTAL 24MHz 50 ppm(@{"Id":"UWFKNTOT\KOMNAVMF"})
- Drawn
- Name
- Date
- Drawing Title
- Checked
- Drawing No.
- Approved
- Size
- A4
- Ver.
- Rev.
- Sheet
- Of

### Library data of the parts
C54-C65 = CAP_SMD_FILM_1u16v_1210: as C19 on sheet AUX Power; PRICE: 100= 36$; DESC: -; PARAM2: 16V; ASSEMBLY: ASSEMBLY
  C54-C56 C58-C60 C62 C63: VALUE: 100nF
  C57 C61 C65: VALUE: 1.0uF-16V
  C64: VALUE: 0.1uF
C66 C67 = CAP_SMD_MLCC: CAP, MLCC, 1nF, 50V, C0G, 10%, 0402; MANF: Murata; PARAM: C0G, 10%; PRICE: 100= 1.4$; DESC: -; MANF_P#: -; PARAM2: 50V; ASSEMBLY: ASSEMBLY; VALUE: 30PF
D10 = LED_SMD_0603_RED: as D9 on sheet AUX Power; MANF: MANF; ASSEMBLY: ASSEMBLY; PRICE: PRICE; VALUE: LED603RED
IC11 = USB2514B-AEZG: Integrated Circuit; Manufacturer_Name: Microchip; Datasheet Link: http://ww1.microchip.com/downloads/en/DeviceDoc/00001692C.pdf; Height: 1mm; Manufacturer_Part_Number: USB2514B-AEZG; Mouser Part Number: 886-USB2514B-AEZG; Mouser Price/Stock: https://www.mouser.co.uk/ProductDetail/Microchip-Technology/USB2514B-AEZG?qs=ydWXD%252B8LvLCxuNqQPTEcVA%3D%3D; Arrow Part Number: USB2514B-AEZG; Arrow Price/Stock: https://www.arrow.com/en/products/usb2514b-aezg/microchip-technology?region=nac
JP2 = JUMPER_SOLDER: JUMPER, HEADER 2PIN; MANF: MANF; MANF_P#: MANF_P#; VALUE: JMPSOLDER
R23 = RES_SMD_0603: RESISTOR, SMD; PARAM: -W; DESC: DESCRIPTION; DIST#: MOUSER; MANF_P#: -; MANF: -; ASSEMBLY: ASSEMBLY; PRICE: 100= 0.5$; PARAM2: 1%; VALUE: 12.0k    1%
R24-R32 = RES_SMD_0603: as R5 on sheet AUX Power; MANF_P#: -; MANF: -; ASSEMBLY: ASSEMBLY; PRICE: 100= 0.5$
  R24-R30: VALUE: 100K
  R31: VALUE: 330E
  R32: VALUE: 1M
X2 = XTL_2_HC49_8MHz_SMD: Crystal MOST POPULAR ABL HC49 PACKAGE; MANF: ABRACON; MANF_P#: ABLS-8.000MHZ-B4-T; PARAM: 8MHz, 18pF, 30PPM, -20~70oC; PRICE: 0.3$; VALUE: XTL_24MHz

## Sheet BIT(Built in Test).SchDoc
size 297 x 209 mm; SheetNumber: 8; SheetTotal: 29
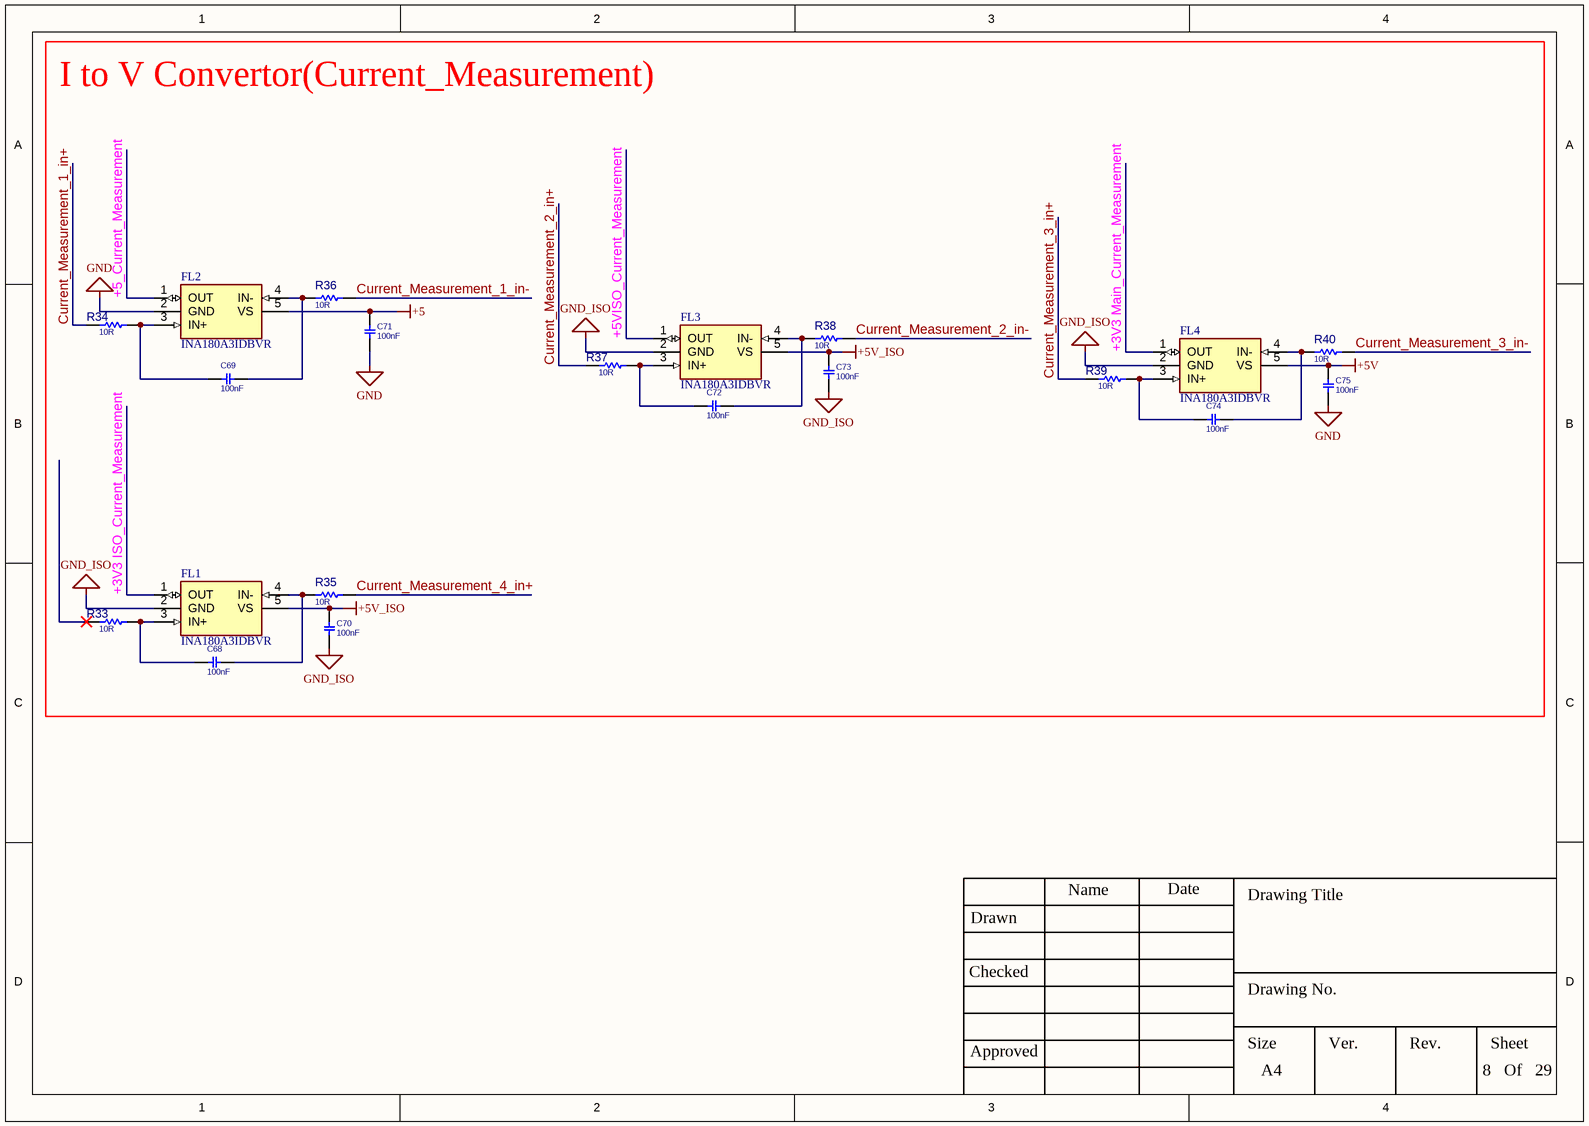
[diagram p5: BIT(Built in Test).SchDoc]

### Parts
C68  100nF  [C0603]
C69  100nF  [C0603]
C70  100nF  [C0603]
C71  100nF  [C0603]
C72  100nF  [C0603]
C73  100nF  [C0603]
C74  100nF  [C0603]
C75  100nF  [C0603]
FL1  INA180A3IDBVR  [SOT95P280X145-5N]
FL2  INA180A3IDBVR  [SOT95P280X145-5N]
FL3  INA180A3IDBVR  [SOT95P280X145-5N]
FL4  INA180A3IDBVR  [SOT95P280X145-5N]
R33  10R  [R2512]
R34  10R  [R2512]
R35  10R  [R2512]
R36  10R  [R2512]
R37  10R  [R2512]
R38  10R  [R2512]
R39  10R  [R2512]
R40  10R  [R2512]

### Blocks framed on the sheet
I to V Convertor(Current_Measurement): C68-C75 FL1-FL4 R33-R40

### Nets
+5V: C75.2 FL4.5(VS)
Current_Measurement_1_in-: C71.2 FL2.5(VS) R36.2  [also labelled +5]
Current_Measurement_2_in-: C70.2 C73.2 FL1.5(VS) FL3.5(VS) R38.2  [also labelled +5V_ISO]
Current_Measurement_3_in+: R39.1  [project net Audio_VDD_3V3]
Current_Measurement_4_in+: R35.2
GND: C71.1 C75.1 FL2.2(GND)
GND_ISO: C70.1 C73.1 FL1.2(GND) FL3.2(GND) FL4.2(GND)
+3V3 ISO_Current_Measurement: FL1.1(OUT)
+3V3 Main_Current_Measurement: FL4.1(OUT)
+5_Current_Measurement: FL2.1(OUT)
+5VISO_Current_Measurement: FL3.1(OUT)
Current_Measurement_1_in+: R34.1
Current_Measurement_2_in+: R37.1
Current_Measurement_3_in-: R40.2
NetC68_1: C68.1 FL1.4(IN-) R35.1
NetC68_2: C68.2 FL1.3(IN+) R33.2
NetC69_1: C69.1 FL2.4(IN-) R36.1
NetC69_2: C69.2 FL2.3(IN+) R34.2
NetC72_1: C72.1 FL3.4(IN-) R38.1
NetC72_2: C72.2 FL3.3(IN+) R37.2
NetC74_1: C74.1 FL4.4(IN-) R40.1
NetC74_2: C74.2 FL4.3(IN+) R39.2

Not connected (* = marked no-connect by the designer): R33 1*

### Notes on the sheet
- Drawn
- Name
- Date
- Drawing Title
- Checked
- Drawing No.
- Approved
- Size
- A4
- Ver.
- Rev.
- Sheet
- Of

### Library data of the parts
C68-C75 = CAP_SMD_MLCC_10u25V_0603: CAP, MLCC; MANF_P#: GRM188R61E106KA73; MANF: Murata; PARAM: X5R, 10%; PARAM2: 25V; PRICE: 100=15$; VALUE: 100nF
FL1-FL4 = INA180A3IDBVR: Filter; Manufacturer_Name: Texas Instruments; Datasheet Link: http://www.ti.com/lit/gpn/INA180; Height: 1.45mm; Manufacturer_Part_Number: INA180A3IDBVR; Mouser Part Number: 595-INA180A3IDBVR; Mouser Price/Stock: https://www.mouser.co.uk/ProductDetail/Texas-Instruments/INA180A3IDBVR?qs=5aG0NVq1C4xT61h4EgbaIA%3D%3D; Arrow Part Number: INA180A3IDBVR; Arrow Price/Stock: https://www.arrow.com/en/products/ina180a3idbvr/texas-instruments?region=nac
R33-R40 = RES_SMD_2512: as R1 on sheet Main Power; MANF_P#: -; MANF: -; ASSEMBLY: ASSEMBLY; PRICE: 100= 0.5$; VALUE: 10R

## Sheet Test Points.SchDoc
size 297 x 209 mm; SheetNumber: 9; SheetTotal: 29
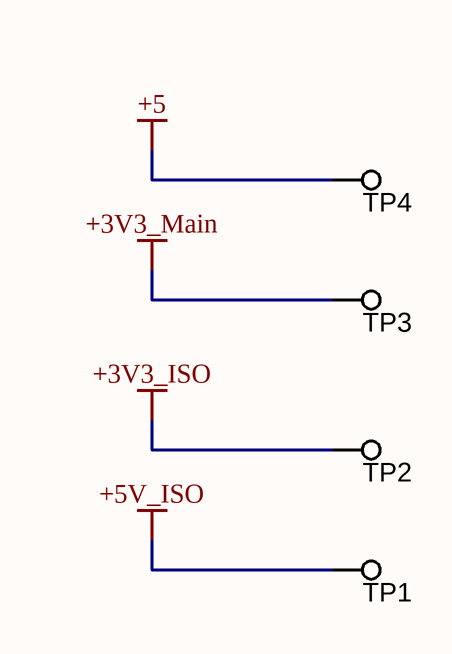
[diagram p6: Test Points.SchDoc]

### Parts
TP1  TESTPOINT_PROBE  [TP80D50]  (value not drawn)  (no BOM)
TP2  TESTPOINT_PROBE  [TP80D50]  (value not drawn)  (no BOM)
TP3  TESTPOINT_PROBE  [TP80D50]  (value not drawn)  (no BOM)
TP4  TESTPOINT_PROBE  [TP80D50]  (value not drawn)  (no BOM)

### Nets
+3V3_ISO: TP2.1  [project net Current_Measurement_4_in+]
+3V3_Main: TP3.1  [project net Audio_VDD_3V3]
+5: TP4.1  [project net Current_Measurement_1_in-]
+5V_ISO: TP1.1  [project net Current_Measurement_2_in-]

### Notes on the sheet
- Drawn
- Name
- Date
- Drawing Title
- Checked
- Drawing No.
- Approved
- Size
- A4
- Ver.
- Rev.
- Sheet
- Of

### Library data of the parts
TP1-TP4 = TESTPOINT_PROBE: TEST POINT; MANF: MANF; MANF_P#: MANF_P#; VALUE: VALUE

## Sheet RS232.SchDoc
size 297 x 209 mm; SheetNumber: 10; SheetTotal: 29
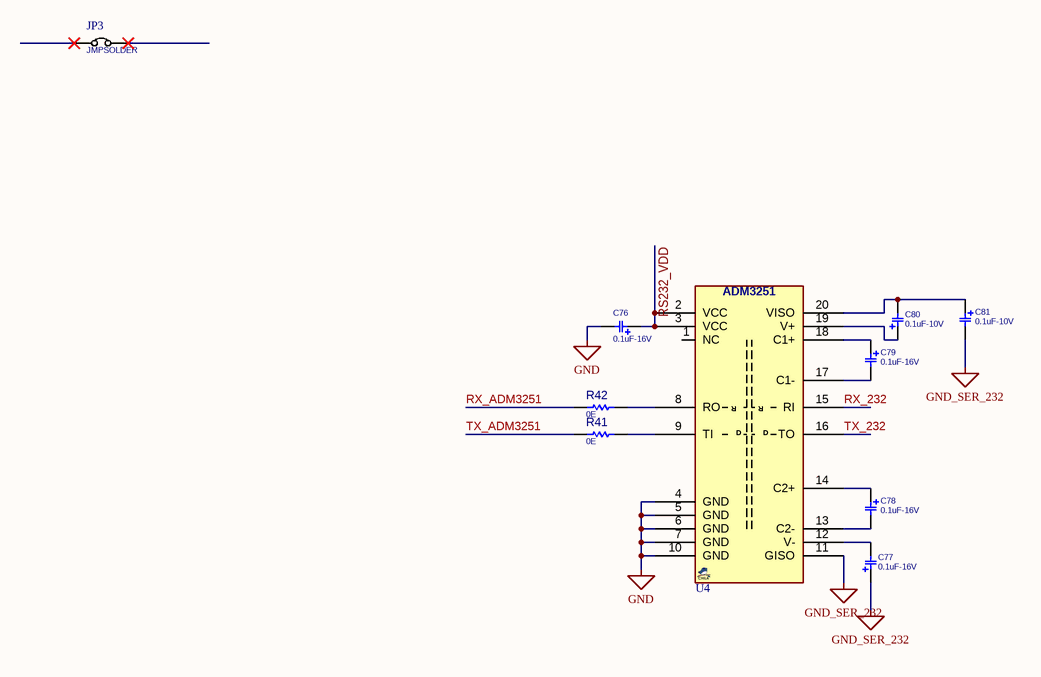
[diagram p7: RS232.SchDoc]

### Parts
C76  0.1uF-16V  [C_TN_3216]
C77  0.1uF-16V  [C_TN_3216]
C78  0.1uF-16V  [C_TN_3216]
C79  0.1uF-16V  [C_TN_3216]
C80  0.1uF-10V  [C_TN_3216]
C81  0.1uF-10V  [C_TN_3216]
JP3  JMPSOLDER  [JP_40X50]
R41  0E  [R0805]
R42  0E  [R0805]
U4  ADM3251  [SO_20_W]  (value not drawn)

### Nets
GND: C76.2 U4.4(GND) U4.5(GND) U4.6(GND) U4.7(GND) U4.10(GND)
GND_SER_232: C77.1 C81.2 U4.11(GISO)
RS232_VDD: C76.1 U4.2(VCC) U4.3(VCC)
RX_232: U4.15(RI)
RX_ADM3251: R42.1
TX_232: U4.16(TO)
TX_ADM3251: R41.1
NetC77_2: C77.2 U4.12(V-)
NetC78_1: C78.1 U4.14(C2+)
NetC78_2: C78.2 U4.13(C2-)
NetC79_1: C79.1 U4.18(C1+)
NetC79_2: C79.2 U4.17(C1-)
NetC80_1: C80.1 U4.19(V+)
NetC80_2: C80.2 C81.1 U4.20(VISO)
NetR41_2: R41.2 U4.9(TI)
NetR42_2: R42.2 U4.8(RO)

Not connected (* = marked no-connect by the designer): JP3 1* 2*; U4 1(NC)

### Notes on the sheet
- Drawn
- Name
- Date
- Drawing Title
- Checked
- Drawing No.
- Approved
- Size
- A4
- Ver.
- Rev.
- Sheet
- Of
- (in symbol ADM3251_SO16W) R; D

### Library data of the parts
C76-C81 = CAP_SMD_TAN_10uF_6.3V: CAP, SMD, TAN; PARAM: 20%, 300mOhm, -55~105oC; MANF: VISHAY; MANF_P#: T55A106M6R3C0300; PARAM2: 6.3V; PRICE: 0.46$
  C76-C79: VALUE: 0.1uF-16V
  C80 C81: VALUE: 0.1uF-10V
JP3 = JUMPER_SOLDER: JUMPER, HEADER 2PIN; MANF: MANF; MANF_P#: MANF_P#; VALUE: JMPSOLDER
R41 R42 = RES_SMD_0805: RESISTOR, SMD; PARAM: -W; DESC: DESCRIPTION; DIST#: MOUSER; PARAM2: 1%; MANF_P#: -; MANF: -; ASSEMBLY: ASSEMBLY; PRICE: 100= 0.5$; VALUE: 0E
U4 = ADM3251_SO16W: RS-485 Transceiver, Isolated, iIntegrated Transformer Driver, 460kbps; MANF: Analog Devices; MANF_P#: ADM3251EARWZ; PARAM2: 5/3.3 (VDD1); PARAM: 2.5KV Isolating, 460kbps, -40~85°C; PRICE: 7$; VALUE: ADM3251

## Sheet RS485.SchDoc
size 297 x 209 mm; SheetNumber: 11; SheetTotal: 29
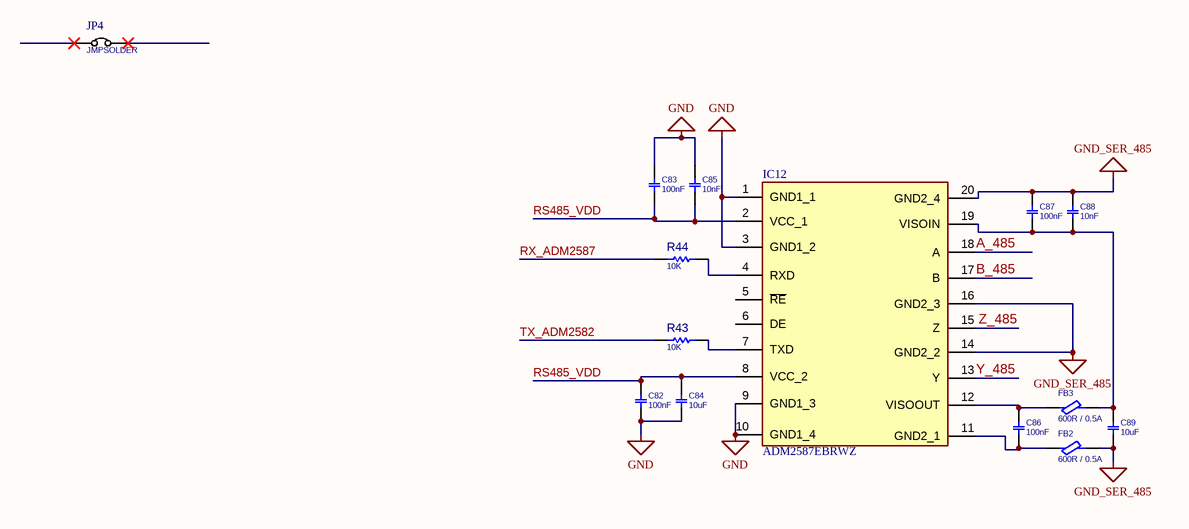
[diagram p8: RS485.SchDoc]

### Parts
C82  100nF  [C0603]
C83  100nF  [C0603]
C84  10uF  [C0603]
C85  10nF  [C0603]
C86  100nF  [C0603]
C87  100nF  [C0603]
C88  10nF  [C0603]
C89  10uF  [C0603]
FB2  600R / 0.5A  [L0603]
FB3  600R / 0.5A  [L0603]
IC12  ADM2587EBRWZ  [SOIC127P1032X265-20N]
JP4  JMPSOLDER  [JP_40X50]
R43  10K  [R0805]
R44  10K  [R0805]

### Nets
GND: C82.1 C83.2 C84.2 C85.1 IC12.1(GND1_1) IC12.3(GND1_2) IC12.9(GND1_3) IC12.10(GND1_4)
GND_SER_485: C87.2 C88.1 C89.1 FB2.2 IC12.14(GND2_2) IC12.16(GND2_3) IC12.20(GND2_4)
A_485: IC12.18(A)
B_485: IC12.17(B)
RS485_VDD: C82.2 C83.1 C84.1 C85.2 IC12.2(VCC_1) IC12.8(VCC_2)
RX_ADM2587: R44.1
TX_ADM2582: R43.1
Y_485: IC12.13(Y)
Z_485: IC12.15(Z)
NetC86_1: C86.1 FB2.1 IC12.11(GND2_1)
NetC86_2: C86.2 FB3.1 IC12.12(VISOOUT)
NetC87_1: C87.1 C88.2 C89.2 FB3.2 IC12.19(VISOIN)
NetIC12_4: IC12.4(RXD) R44.2
NetIC12_7: IC12.7(TXD) R43.2

Not connected (* = marked no-connect by the designer): IC12 5(~{RE}) 6(DE); JP4 1* 2*

### Notes on the sheet
- Drawn
- Name
- Date
- Drawing Title
- Checked
- Drawing No.
- Approved
- Size
- A4
- Ver.
- Rev.
- Sheet
- Of

### Library data of the parts
C82-C89 = CAP_SMD_MLCC_10u25V_0603: as C68 on sheet BIT(Built in Test); PRICE: 100=15$
  C82 C83 C86 C87: VALUE: 100nF
  C84 C89: VALUE: 10uF
  C85 C88: VALUE: 10nF
FB2 FB3 = FBEAD_SMD_MPZ1608S102: as FB1 on sheet Terminals; PARAM: 1000@100MHz; PARAM2: 0.8A; PRICE: 100= 3.4$; VALUE: 600R / 0.5A
IC12 = ADM2587EBRWZ: Integrated Circuit; Manufacturer_Name: Analog Devices; Datasheet Link: http://www.analog.com/static/imported-files/data_sheets/ADM2582E_2587E.pdf; Height: 2.65mm; Manufacturer_Part_Number: ADM2587EBRWZ; Mouser Part Number: 584-ADM2587EBRWZ; Mouser Price/Stock: https://www.mouser.co.uk/ProductDetail/Analog-Devices/ADM2587EBRWZ?qs=BpaRKvA4VqEzsBsna6VmlA%3D%3D; Arrow Part Number: ADM2587EBRWZ; Arrow Price/Stock: https://www.arrow.com/en/products/adm2587ebrwz/analog-devices?region=nac
JP4 = JUMPER_SOLDER: JUMPER, HEADER 2PIN; MANF: MANF; MANF_P#: MANF_P#; VALUE: JMPSOLDER
R43 R44 = RES_SMD_0805: as R41 on sheet RS232; MANF_P#: -; MANF: -; ASSEMBLY: ASSEMBLY; PRICE: 100= 0.5$; VALUE: 10K

## Sheet Power Switch.SchDoc
size 297 x 209 mm; SheetNumber: 12; SheetTotal: 29
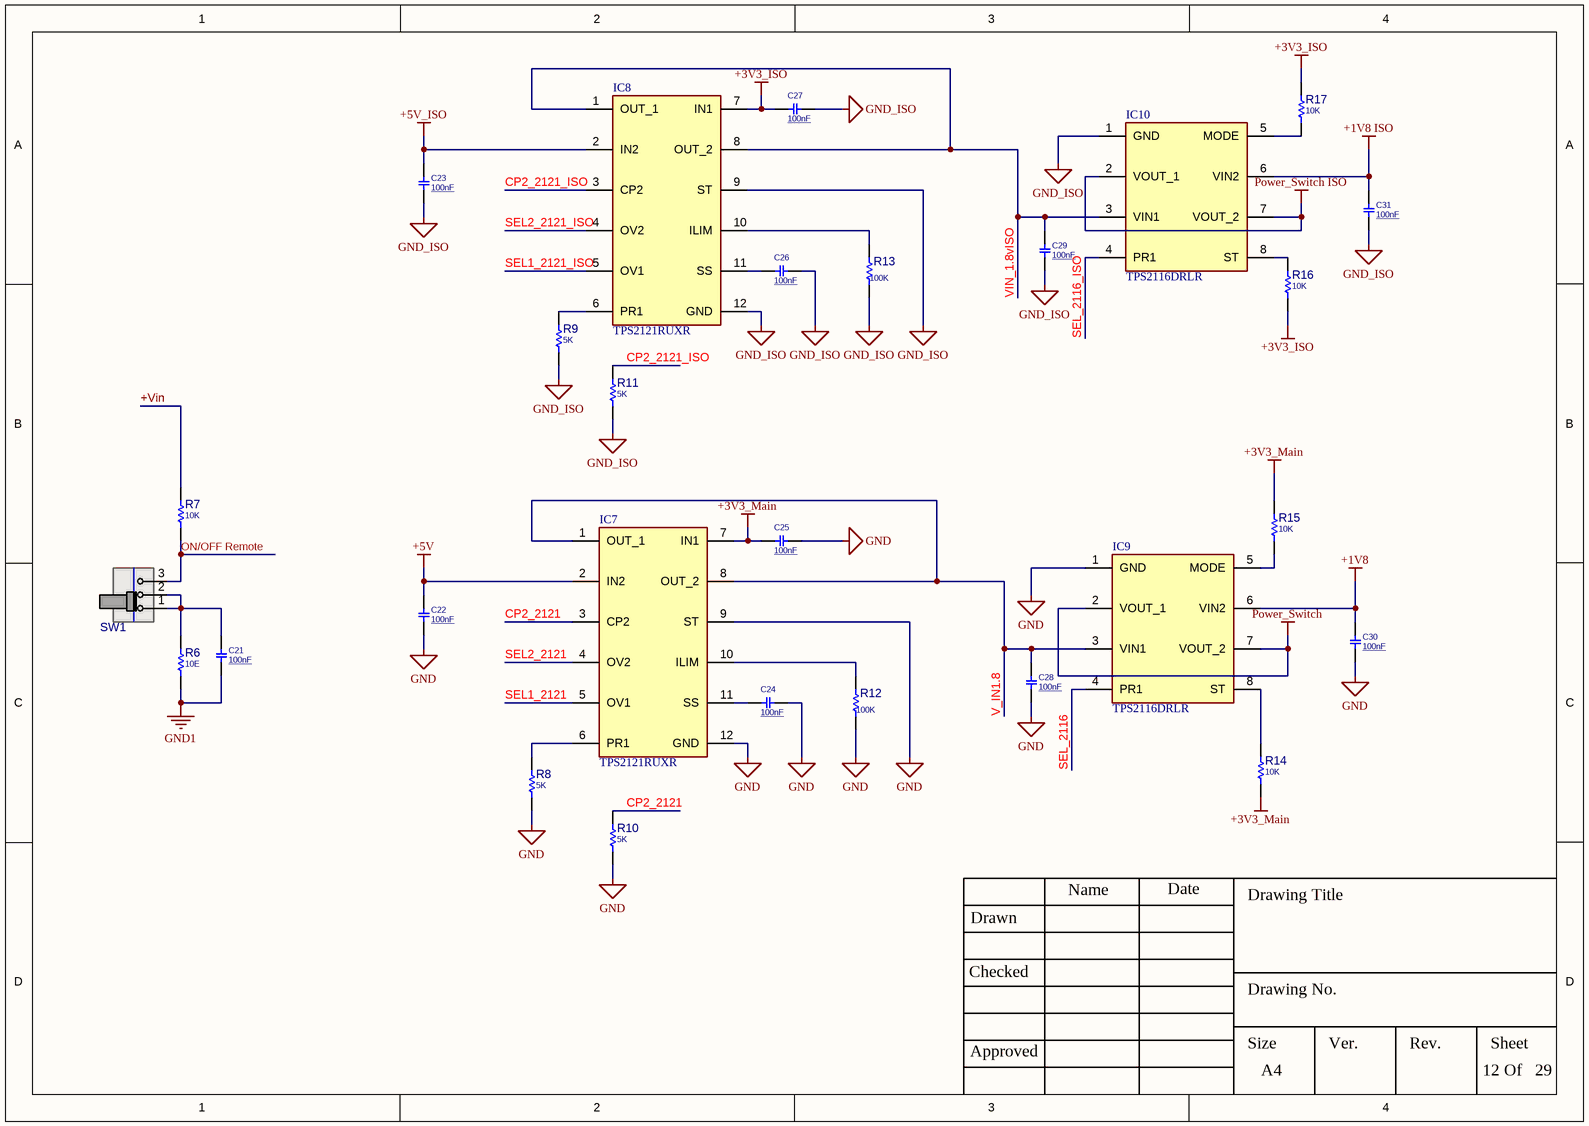
[diagram p9: Power Switch.SchDoc]

### Parts
C21  100nF  [C1206]
C22  100nF  [C0603]
C23  100nF  [C0603]
C24  100nF  [C0603]
C25  100nF  [C0603]
C26  100nF  [C0603]
C27  100nF  [C0603]
C28  100nF  [C0603]
C29  100nF  [C0603]
C30  100nF  [C0603]
C31  100nF  [C0603]
IC7  TPS2121RUXR  [TPS2121RUXR]
IC8  TPS2121RUXR  [TPS2121RUXR]
IC9  TPS2116DRLR  [SOTFL50P160X60-8N]
IC10  TPS2116DRLR  [SOTFL50P160X60-8N]
R6  10E  [R0603]
R7  10K  [R1206]
R8  5K  [R0603]
R9  5K  [R0603]
R10  5K  [R0603]
R11  5K  [R0603]
R12  value 100K  [R0603]  (hidden comment: 0R)
R13  value 100K  [R0603]  (hidden comment: 10K)
R14  10K  [R0603]
R15  10K  [R0603]
R16  10K  [R0603]
R17  10K  [R0603]
SW1  SlideSwitch  [SWSLIDT_SPDT_R_8X4]  (value not drawn)

### Nets
+1V8: C30.1 IC9.6(VIN2)  [project net Audio_VDD_1V8]
+1V8 ISO: C31.1 IC10.6(VIN2)
+3V3_ISO: C27.1 IC8.7(IN1) R16.2 R17.2  [project net Current_Measurement_4_in+]
+3V3_Main: C25.1 IC7.7(IN1) R14.2 R15.2  [project net Audio_VDD_3V3]
+5V: C22.1 IC7.2(IN2)
+5V_ISO: C23.1 IC8.2(IN2)  [project net Current_Measurement_2_in-]
GND: C22.2 C24.1 C25.2 C28.2 C30.2 IC7.9(ST) IC7.12(GND) IC9.1(GND) R8.1 R10.1 R12.1
GND1: C21.1 R6.1
GND_ISO: C23.2 C26.1 C27.2 C29.2 C31.2 IC8.9(ST) IC8.12(GND) IC10.1(GND) R9.1 R11.1 R13.1
Power_Switch: IC9.2(VOUT_1) IC9.7(VOUT_2)
Power_Switch ISO: IC10.2(VOUT_1) IC10.7(VOUT_2)
+Vin: R7.1
CP2_2121: IC7.3(CP2) R10.2
CP2_2121_ISO: IC8.3(CP2) R11.2
ON/OFF Remote: R7.2 SW1.3(P4)
SEL1_2121: IC7.5(OV1)
SEL1_2121_ISO: IC8.5(OV1)
SEL2_2121: IC7.4(OV2)
SEL2_2121_ISO: IC8.4(OV2)
SEL_2116: IC9.4(PR1)
SEL_2116_ISO: IC10.4(PR1)
V_IN1.8: C28.1 IC7.1(OUT_1) IC7.8(OUT_2) IC9.3(VIN1)
VIN_1.8vISO: C29.1 IC8.1(OUT_1) IC8.8(OUT_2) IC10.3(VIN1)
NetC21_2: C21.2 R6.2 SW1.1(P1) SW1.2(P3)
NetC24_2: C24.2 IC7.11(SS)
NetC26_2: C26.2 IC8.11(SS)
NetIC7_6: IC7.6(PR1) R8.2
NetIC7_10: IC7.10(ILIM) R12.2
NetIC8_6: IC8.6(PR1) R9.2
NetIC8_10: IC8.10(ILIM) R13.2
NetIC9_5: IC9.5(MODE) R15.1
NetIC9_8: IC9.8(ST) R14.1
NetIC10_5: IC10.5(MODE) R17.1
NetIC10_8: IC10.8(ST) R16.1

### Notes on the sheet
- Drawn
- Name
- Date
- Drawing Title
- Checked
- Drawing No.
- Approved
- Size
- A4
- Ver.
- Rev.
- Sheet
- Of

### Library data of the parts
C21 = CAP_SMD_MLCC_1206: CAP, MLCC, -F, -V, MATERIAL, -%, 0201; PARAM: -, -%; MANF_P#: MANF_PART#; PRICE: 100= 1$; MANF: -; PARAM2: -V; ASSEMBLY: ASSEMBLY; VALUE: 100nF
C22-C31 = CAP_SMD_MLCC_0603: CAP, MLCC, -F, -V, MATERIAL, -%, 0201; PARAM: -, -%; MANF_P#: MANF_PART#; PRICE: 100= 1$; MANF: -; PARAM2: -V; ASSEMBLY: ASSEMBLY; VALUE: 100nF
IC7 IC8 = TPS2121RUXR: Integrated Circuit; Manufacturer_Name: Texas Instruments; Datasheet Link: https://www.ti.com/lit/gpn/TPS2121; Height: 1mm; Manufacturer_Part_Number: TPS2121RUXR; Mouser Part Number: 595-TPS2121RUXR; Mouser Price/Stock: https://www.mouser.co.uk/ProductDetail/Texas-Instruments/TPS2121RUXR?qs=qSfuJ%252Bfl%2Fd7dCYiVnUfngQ%3D%3D; Arrow Part Number: TPS2121RUXR; Arrow Price/Stock: null?utm_currency=USD&region=nac
IC9 IC10 = TPS2116DRLR: Integrated Circuit; Manufacturer_Name: Texas Instruments; Datasheet Link: https://www.ti.com/lit/gpn/tps2116; Height: 0.6mm; Manufacturer_Part_Number: TPS2116DRLR; Mouser Part Number: 595-TPS2116DRLR; Mouser Price/Stock: https://www.mouser.co.uk/ProductDetail/Texas-Instruments/TPS2116DRLR?qs=aP1CjGhiNiGo3XAyXcVPaQ%3D%3D; Arrow Part Number: TPS2116DRLR; Arrow Price/Stock: https://www.arrow.com/en/products/tps2116drlr/texas-instruments?region=nac
R6 R8-R17 = RES_SMD_0603: as R5 on sheet AUX Power; MANF_P#: -; MANF: -; ASSEMBLY: ASSEMBLY; PRICE: 100= 0.5$
  R6: VALUE: 10E
  R8-R11: VALUE: 5K
  R14-R17: VALUE: 10K
R7 = RES_SMD_1206: RESISTOR, SMD; PARAM: -W; DESC: DESCRIPTION; DIST#: MOUSER; PARAM2: 1%; MANF_P#: -; MANF: -; ASSEMBLY: ASSEMBLY; PRICE: 100= 0.5$; VALUE: 10K
SW1 = SWSLIDT_SPDT_R_8X4: SWITCH, SLIDE, SPDT, 8X4mm, THD; MANF_PART#: MHSS1105; MANF: Apem; DESC: DESCRIPTION; VALUE: SlideSwitch; ASSEMBLY: ASSEMBLY; PARAM: PARAM; PRICE: 0.5$

## Sheet Display .SchDoc
size 297 x 209 mm; SheetNumber: 13; SheetTotal: 29
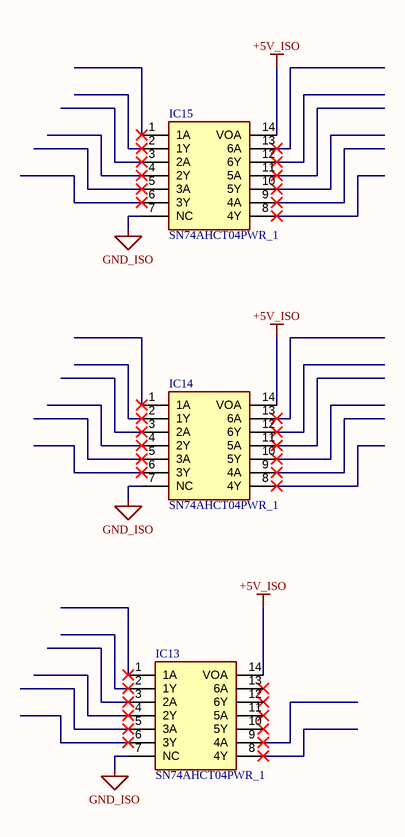
[diagram p10: Display .SchDoc]

### Parts
IC13  SN74AHCT04PWR_1  [SOP65P640X120-14N]
IC14  SN74AHCT04PWR_1  [SOP65P640X120-14N]
IC15  SN74AHCT04PWR_1  [SOP65P640X120-14N]

### Nets
+5V_ISO: IC13.14(VOA) IC14.14(VOA) IC15.14(VOA)  [project net Current_Measurement_2_in-]
GND_ISO: IC13.7(NC) IC14.7(NC) IC15.7(NC)

Not connected (* = marked no-connect by the designer): IC13 1(1A)* 2(1Y)* 3(2A)* 4(2Y)* 5(3A)* 6(3Y)* 8(4Y)* 9(4A)* 10(5Y)* 11(5A)* 12(6Y)* 13(6A)*; IC14 1(1A)* 2(1Y)* 3(2A)* 4(2Y)* 5(3A)* 6(3Y)* 8(4Y)* 9(4A)* 10(5Y)* 11(5A)* 12(6Y)* 13(6A)*; IC15 1(1A)* 2(1Y)* 3(2A)* 4(2Y)* 5(3A)* 6(3Y)* 8(4Y)* 9(4A)* 10(5Y)* 11(5A)* 12(6Y)* 13(6A)*

### Notes on the sheet
- Drawn
- Name
- Date
- Drawing Title
- Checked
- Drawing No.
- Approved
- Size
- A4
- Ver.
- Rev.
- Sheet
- Of

### Library data of the parts
IC13-IC15 = SN74AHCT04PWR_1: Integrated Circuit; Manufacturer_Name: Texas Instruments; Datasheet Link: http://www.ti.com/lit/gpn/sn74ahct04; Height: 1.2mm; Manufacturer_Part_Number: SN74AHCT04PWR; Mouser Part Number: 595-SN74AHCT04PWR; Mouser Price/Stock: https://www.mouser.co.uk/ProductDetail/Texas-Instruments/SN74AHCT04PWR?qs=D5pVkbrsqqJ8K2Qvm77JIw%3D%3D; Arrow Part Number: SN74AHCT04PWR; Arrow Price/Stock: https://www.arrow.com/en/products/sn74ahct04pwr/texas-instruments?region=nac

## Sheet Buffers.SchDoc
size 297 x 209 mm; SheetNumber: 14; SheetTotal: 29
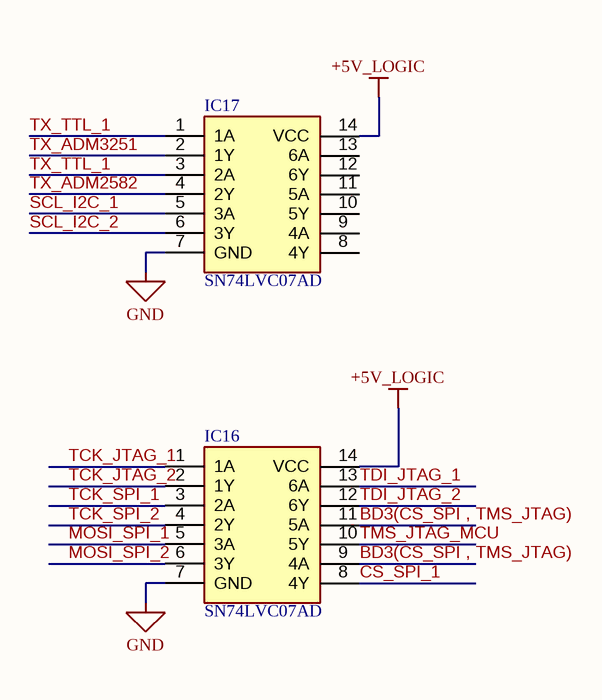
[diagram p11: Buffers.SchDoc]

### Parts
IC16  SN74LVC07AD  [SOIC127P600X175-14N]
IC17  SN74LVC07AD  [SOIC127P600X175-14N]

### Nets
+5V_LOGIC: IC16.14(VCC) IC17.14(VCC)  [project net Serial_VDD]
GND: IC16.7(GND) IC17.7(GND)
BD3(CS_SPI , TMS_JTAG): IC16.9(4A) IC16.11(5A)
CS_SPI_1: IC16.8(4Y)
MOSI_SPI_1: IC16.5(3A) IC16.13(6A)  [also labelled TDI_JTAG_1]
MOSI_SPI_2: IC16.6(3Y)
SCL_I2C_1: IC17.1(1A) IC17.3(2A) IC17.5(3A)  [also labelled TX_TTL_1]
SCL_I2C_2: IC17.6(3Y)
TCK_JTAG_1: IC16.1(1A) IC16.3(2A)  [also labelled TCK_SPI_1]
TCK_JTAG_2: IC16.2(1Y)
TCK_SPI_2: IC16.4(2Y)
TDI_JTAG_2: IC16.12(6Y)
TMS_JTAG_MCU: IC16.10(5Y)
TX_ADM2582: IC17.4(2Y)
TX_ADM3251: IC17.2(1Y)

Not connected (* = marked no-connect by the designer): IC17 8(4Y) 9(4A) 10(5Y) 11(5A) 12(6Y) 13(6A)

### Notes on the sheet
- Drawn
- Name
- Date
- Drawing Title
- Checked
- Drawing No.
- Approved
- Size
- A4
- Ver.
- Rev.
- Sheet
- Of

### Library data of the parts
IC16 IC17 = SN74LVC07AD: Integrated Circuit; Manufacturer_Name: Texas Instruments; Datasheet Link: http://www.ti.com/lit/ds/symlink/sn74lvc07a.pdf; Height: 1.75mm; Manufacturer_Part_Number: SN74LVC07AD; Mouser Part Number: 595-SN74LVC07AD; Mouser Price/Stock: https://www.mouser.co.uk/ProductDetail/Texas-Instruments/SN74LVC07AD?qs=8yeEWhuAOtMkbU1H3MsIVg%3D%3D; Arrow Part Number: SN74LVC07AD; Arrow Price/Stock: https://www.arrow.com/en/products/sn74lvc07ad/texas-instruments?region=nac

## Sheet Mode Switch.SchDoc
size 297 x 209 mm; SheetNumber: 15; SheetTotal: 29
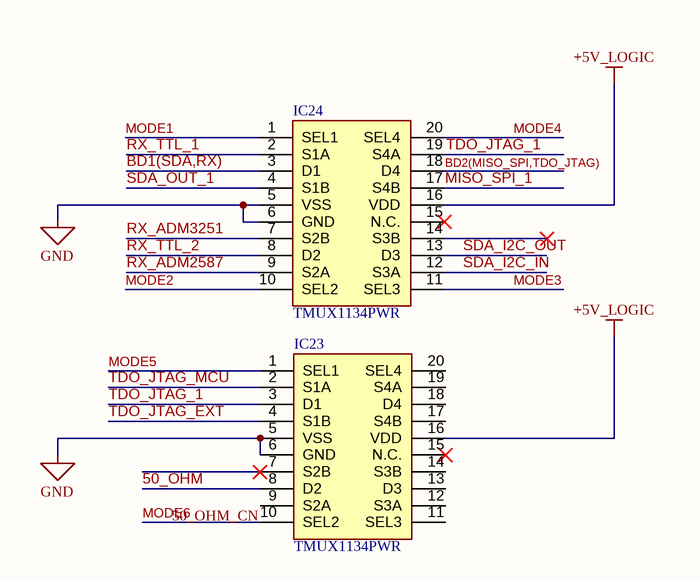
[diagram p12: Mode Switch.SchDoc]

### Parts
IC23  TMUX1134PWR  [SOP65P640X120-20N]
IC24  TMUX1134PWR  [SOP65P640X120-20N]

### Nets
+5V_LOGIC: IC23.16(VDD) IC24.16(VDD)  [project net Serial_VDD]
GND: IC23.5(VSS) IC23.6(GND) IC24.5(VSS) IC24.6(GND)
50_OHM: IC23.8(D2)
50_OHM_CN: IC23.9(S2A)
BD1(SDA,RX): IC24.3(D1)
BD2(MISO_SPI,TDO_JTAG): IC24.18(D4)
MISO_SPI_1: IC24.17(S4B)
MODE1: IC24.1(SEL1)
MODE2: IC24.10(SEL2)
MODE3: IC24.11(SEL3)
MODE4: IC24.20(SEL4)
MODE5: IC23.1(SEL1)
MODE6: IC23.10(SEL2)
RX_ADM2587: IC24.9(S2A)
RX_ADM3251: IC24.7(S2B)
RX_TTL_1: IC24.2(S1A)
RX_TTL_2: IC24.8(D2)
SDA_I2C_IN: IC24.12(S3A)
SDA_I2C_OUT: IC24.13(D3)
SDA_OUT_1: IC24.4(S1B)
TDO_JTAG_1: IC23.3(D1) IC24.19(S4A)
TDO_JTAG_EXT: IC23.4(S1B)
TDO_JTAG_MCU: IC23.2(S1A)

Not connected (* = marked no-connect by the designer): IC23 7(S2B)* 11(SEL3) 12(S3A) 13(D3) 14(S3B) 15(N.C.)* 17(S4B) 18(D4) 19(S4A) 20(SEL4); IC24 14(S3B)* 15(N.C.)*

### Notes on the sheet
- Drawn
- Name
- Date
- Drawing Title
- Checked
- Drawing No.
- Approved
- Size
- A4
- Ver.
- Rev.
- Sheet
- Of

### Library data of the parts
IC23 IC24 = TMUX1134PWR: Integrated Circuit; Manufacturer_Name: Texas Instruments; Datasheet Link: https://www.ti.com/lit/gpn/TMUX1134; Height: 1.2mm; Manufacturer_Part_Number: TMUX1134PWR; Mouser Part Number: 595-TMUX1134PWR; Mouser Price/Stock: https://www.mouser.co.uk/ProductDetail/Texas-Instruments/TMUX1134PWR?qs=%252B6g0mu59x7L8VGQncKsYmQ%3D%3D; Arrow Part Number: TMUX1134PWR; Arrow Price/Stock: null?region=nac

## Sheet Level Shifting.SchDoc
size 297 x 209 mm; SheetNumber: 16; SheetTotal: 29
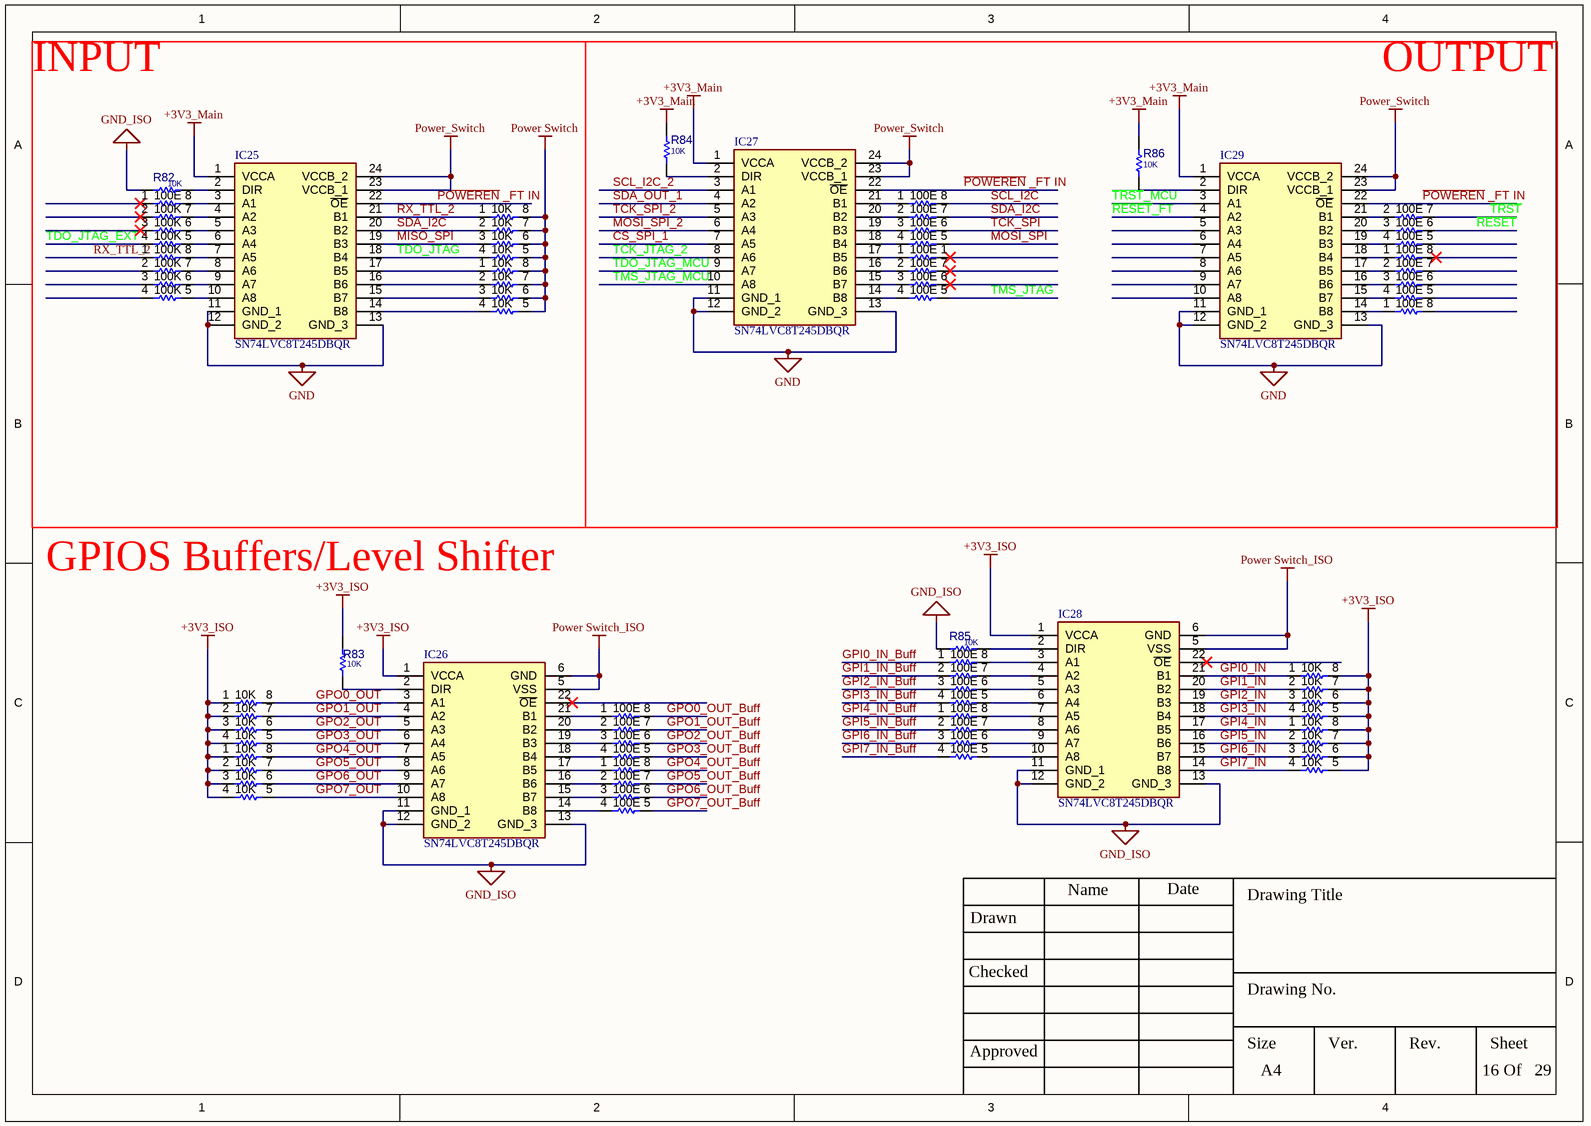
[diagram p13: Level Shifting.SchDoc]

### Parts
1  value 10K  [RP0603X4]  (hidden comment: Film Res Pack)  (part A of 4)
IC25  SN74LVC8T245DBQR  [SOP64P600X175-24N]
IC26  SN74LVC8T245DBQR  [SOP64P600X175-24N]
IC27  SN74LVC8T245DBQR  [SOP64P600X175-24N]
IC28  SN74LVC8T245DBQR  [SOP64P600X175-24N]
IC29  SN74LVC8T245DBQR  [SOP64P600X175-24N]
R82  10K  [R0603]
R83  10K  [R0603]
R84  10K  [R0603]
R85  10K  [R0603]
R86  10K  [R0603]
RA1  value 100K  [RP0603X4]  (hidden comment: Film Res Pack)  (parts A,B,C,D of 4)
RA2  value 100E  [RP0603X4]  (hidden comment: Film Res Pack)  (parts A,B,C,D of 4)
RA3  value 10K  [RP0603X4]  (hidden comment: Film Res Pack)  (parts A,B,C,D of 4)
RA4  value 10K  [RP0603X4]  (hidden comment: Film Res Pack)  (parts A,B,C,D of 4)
RA5  value 10K  [RP0603X4]  (hidden comment: Film Res Pack)  (parts A,B,C,D of 4)
RA6  value 100E  [RP0603X4]  (hidden comment: Film Res Pack)  (parts A,B,C,D of 4)
RA7  value 100E  [RP0603X4]  (hidden comment: Film Res Pack)  (parts A,B,C,D of 4)
RA8  value 100E  [RP0603X4]  (hidden comment: Film Res Pack)  (parts A,B,C,D of 4)
RA9  value 100E  [RP0603X4]  (hidden comment: Film Res Pack)  (parts A,B,C,D of 4)
RA10  value 100E  [RP0603X4]  (hidden comment: Film Res Pack)  (parts A,B,C,D of 4)
RA11  value 100E  [RP0603X4]  (hidden comment: Film Res Pack)  (parts A,B,C,D of 4)
RA12  value 10K  [RP0603X4]  (hidden comment: Film Res Pack)  (parts A,B,C,D of 4)
RA13  value 10K  [RP0603X4]  (hidden comment: Film Res Pack)  (parts A,B,C,D of 4)
RA14  value 100E  [RP0603X4]  (hidden comment: Film Res Pack)  (parts A,B,C,D of 4)
RA15  value 100E  [RP0603X4]  (hidden comment: Film Res Pack)  (parts A,B,C,D of 4)
RA16  value 100E  [RP0603X4]  (hidden comment: Film Res Pack)  (parts B,C,D of 4)

### Nets
+3V3_ISO: 1.1 IC26.1(VCCA) IC28.1(VCCA) R83.1 RA3.1 RA3.2 RA3.3 RA3.4 RA4.2 RA4.3 RA4.4 RA12.8 RA13.5 RA13.6 RA13.7 RA13.8 RA14.5 RA14.6 RA14.7  [project net Current_Measurement_4_in+]
+3V3_Main: IC25.1(VCCA) IC27.1(VCCA) IC29.1(VCCA) R84.1 R86.1  [project net Audio_VDD_3V3]
GND: IC25.11(GND_1) IC25.12(GND_2) IC25.13(GND_3) IC27.11(GND_1) IC27.12(GND_2) IC27.13(GND_3) IC29.11(GND_1) IC29.12(GND_2) IC29.13(GND_3)
GND_ISO: IC26.11(GND_1) IC26.12(GND_2) IC26.13(GND_3) IC28.11(GND_1) IC28.12(GND_2) IC28.13(GND_3) R82.1 R85.1
Power Switch: RA4.8 RA5.5 RA5.6 RA5.7 RA5.8 RA6.5 RA6.6 RA6.7
Power Switch_ISO: IC26.5(VSS) IC26.6(GND) IC28.5(VSS) IC28.6(GND)
Power_Switch: IC25.23(VCCB_1) IC25.24(VCCB_2) IC27.23(VCCB_1) IC27.24(VCCB_2) IC29.23(VCCB_1) IC29.24(VCCB_2)
~{POWEREN} _FT IN: IC25.22(~{OE}) IC27.22(~{OE}) IC29.22(~{OE})
CS_SPI_1: IC27.7(A5)
GPI0_IN: IC28.21(B1) RA13.1
GPI0_IN_Buff: RA11.1
GPI1_IN: IC28.20(B2) RA14.2
GPI1_IN_Buff: RA12.2
GPI2_IN: IC28.19(B3) RA14.3
GPI2_IN_Buff: RA12.3
GPI3_IN: IC28.18(B4) RA14.4
GPI3_IN_Buff: RA12.4
GPI4_IN: IC28.17(B5) RA12.1
GPI4_IN_Buff: RA10.1
GPI5_IN: IC28.16(B6) RA13.2
GPI5_IN_Buff: RA11.2
GPI6_IN: IC28.15(B7) RA13.3
GPI6_IN_Buff: RA11.3
GPI7_IN: IC28.14(B8) RA13.4
GPI7_IN_Buff: RA11.4
GPO0_OUT: 1.8 IC26.3(A1)
GPO0_OUT_Buff: RA7.8
GPO1_OUT: IC26.4(A2) RA4.7
GPO1_OUT_Buff: RA8.7
GPO2_OUT: IC26.5(A3) RA4.6
GPO2_OUT_Buff: RA8.6
GPO3_OUT: IC26.6(A4) RA4.5
GPO3_OUT_Buff: RA8.5
GPO4_OUT: IC26.7(A5) RA3.8
GPO4_OUT_Buff: RA6.8
GPO5_OUT: IC26.8(A6) RA3.7
GPO5_OUT_Buff: RA7.7
GPO6_OUT: IC26.9(A7) RA3.6
GPO6_OUT_Buff: RA7.6
GPO7_OUT: IC26.10(A8) RA3.5
GPO7_OUT_Buff: RA7.5
MISO_SPI: IC25.19(B3) RA6.3
MOSI_SPI: RA10.5
MOSI_SPI_2: IC27.6(A4)
~{RESET}: RA16.6
~{RESET}_FT: IC29.4(A2)
RX_TTL_2: IC25.21(B1) RA1.1 RA5.1
SCL_I2C: RA9.8 RA10.6  [also labelled TCK_SPI]
SCL_I2C_2: IC27.3(A1)
SDA_I2C: IC25.20(B2) RA6.2 RA10.7
SDA_OUT_1: IC27.4(A2)
~{TRST}: RA16.7
~{TRST}_MCU: IC29.3(A1)
TCK_JTAG_2: IC27.8(A6)
TCK_SPI_2: IC27.5(A3)
TDO_JTAG: IC25.18(B4) RA6.4
TDO_JTAG_EXT: RA2.4
TDO_JTAG_MCU: IC27.9(A7)
TMS_JTAG: RA9.5
TMS_JTAG_MCU: IC27.10(A8)
NetIC25_2: IC25.2(DIR) R82.2
NetIC25_3: IC25.3(A1) RA2.8
NetIC25_4: IC25.4(A2) RA2.7
NetIC25_5: IC25.5(A3) RA2.6
NetIC25_6: IC25.6(A4) RA2.5
NetIC25_7: IC25.7(A5) RA1.8
NetIC25_8: IC25.8(A6) RA1.7
NetIC25_9: IC25.9(A7) RA1.6
NetIC25_10: IC25.10(A8) RA1.5
NetIC25_14: IC25.14(B8) RA5.4
NetIC25_15: IC25.15(B7) RA5.3
NetIC25_16: IC25.16(B6) RA5.2
NetIC25_17: IC25.17(B5) RA4.1
NetIC26_2: IC26.2(DIR) R83.2
NetIC26_14: IC26.14(B8) RA7.4
NetIC26_15: IC26.15(B7) RA7.3
NetIC26_16: IC26.16(B6) RA7.2
NetIC26_17: IC26.17(B5) RA6.1
NetIC26_18: IC26.18(B4) RA8.4
NetIC26_19: IC26.19(B3) RA8.3
NetIC26_20: IC26.20(B2) RA8.2
NetIC26_21: IC26.21(B1) RA7.1
NetIC27_2: IC27.2(DIR) R84.2
NetIC27_14: IC27.14(B8) RA9.4
NetIC27_15: IC27.15(B7) RA9.3
NetIC27_16: IC27.16(B6) RA9.2
NetIC27_17: IC27.17(B5) RA8.1
NetIC27_18: IC27.18(B4) RA10.4
NetIC27_19: IC27.19(B3) RA10.3
NetIC27_20: IC27.20(B2) RA10.2
NetIC27_21: IC27.21(B1) RA9.1
NetIC28_2: IC28.2(DIR) R85.2
NetIC28_3: IC28.3(A1) RA11.8
NetIC28_4: IC28.4(A2) RA12.7
NetIC28_5: IC28.5(A3) RA12.6
NetIC28_6: IC28.6(A4) RA12.5
NetIC28_7: IC28.7(A5) RA10.8
NetIC28_8: IC28.8(A6) RA11.7
NetIC28_9: IC28.9(A7) RA11.6
NetIC28_10: IC28.10(A8) RA11.5
NetIC29_2: IC29.2(DIR) R86.2
NetIC29_14: IC29.14(B8) RA14.1
NetIC29_15: IC29.15(B7) RA15.4
NetIC29_16: IC29.16(B6) RA15.3
NetIC29_17: IC29.17(B5) RA15.2
NetIC29_18: IC29.18(B4) RA15.1
NetIC29_19: IC29.19(B3) RA16.4
NetIC29_20: IC29.20(B2) RA16.3
NetIC29_21: IC29.21(B1) RA16.2

Not connected (* = marked no-connect by the designer): IC26 22(~{OE})*; IC28 22(~{OE})*; IC29 5(A3) 6(A4) 7(A5) 8(A6) 9(A7) 10(A8); RA1 2 3 4; RA2 1* 2* 3*; RA9 6* 7*; RA14 8; RA15 5 6 7 8*; RA16 5

### Notes on the sheet
- INPUT
- OUTPUT
- GPIOS Buffers/Level Shifter
- Drawn
- Name
- Date
- Drawing Title
- Checked
- Drawing No.
- Approved
- Size
- A4
- Ver.
- Rev.
- Sheet
- Of

### Library data of the parts
1 RA1-RA16 = RES_SMD_PACK_X4: RESISTOR, SMD, PACKX4; MANF_P#: MANF_PART#; MANF: MANF
IC25-IC29 = SN74LVC8T245DBQR: Integrated Circuit; Manufacturer_Name: Texas Instruments; Datasheet Link: http://www.ti.com/lit/gpn/sn74lvc8t245; Height: 1.75mm; Manufacturer_Part_Number: SN74LVC8T245DBQR; Mouser Part Number: 595-SN74LVC8T245DBQR; Mouser Price/Stock: https://www.mouser.co.uk/ProductDetail/Texas-Instruments/SN74LVC8T245DBQR?qs=dT9u2OTAaVXsrjZUGB3%252Bbw%3D%3D; Arrow Part Number: SN74LVC8T245DBQR; Arrow Price/Stock: https://www.arrow.com/en/products/sn74lvc8t245dbqr/texas-instruments?region=nac
R82-R86 = RES_SMD_0603: as R5 on sheet AUX Power; MANF_P#: -; MANF: -; ASSEMBLY: ASSEMBLY; PRICE: 100= 0.5$; VALUE: 10K

## Sheet Isolators.SchDoc
size 297 x 209 mm; SheetNumber: 17; SheetTotal: 29
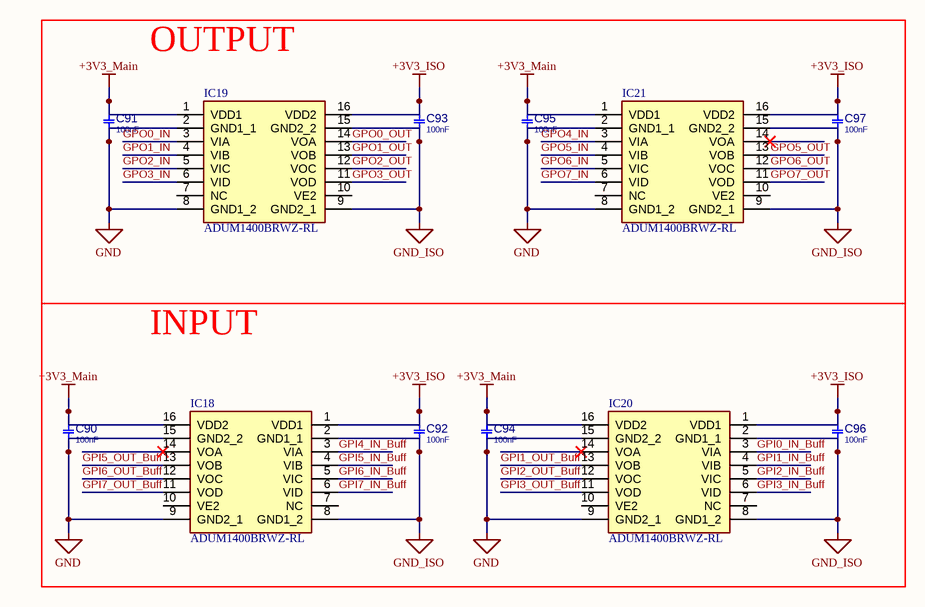
[diagram p14: Isolators.SchDoc]

### Parts
C90  100nF  [C0603]
C91  100nF  [C0603]
C92  100nF  [C0603]
C93  100nF  [C0603]
C94  100nF  [C0603]
C95  100nF  [C0603]
C96  100nF  [C0603]
C97  100nF  [C0603]
IC18  ADUM1400BRWZ-RL  [SOIC127P1032X265-16N]
IC19  ADUM1400BRWZ-RL  [SOIC127P1032X265-16N]
IC20  ADUM1400BRWZ-RL  [SOIC127P1032X265-16N]
IC21  ADUM1400BRWZ-RL  [SOIC127P1032X265-16N]

### Blocks framed on the sheet
OUTPUT: C91 C93 C95 C97 IC19 IC21

### Nets
+3V3_ISO: C92.1 C93.1 C96.1 C97.1 IC18.1(VDD1) IC19.16(VDD2) IC20.1(VDD1) IC21.16(VDD2)  [project net Current_Measurement_4_in+]
+3V3_Main: C90.1 C91.1 C94.1 C95.1 IC18.16(VDD2) IC19.1(VDD1) IC20.16(VDD2) IC21.1(VDD1)  [project net Audio_VDD_3V3]
GND: C90.2 C91.2 C94.2 C95.2 IC18.9(GND2_1) IC18.15(GND2_2) IC19.2(GND1_1) IC19.8(GND1_2) IC20.9(GND2_1) IC20.15(GND2_2) IC21.2(GND1_1) IC21.8(GND1_2)
GND_ISO: C92.2 C93.2 C96.2 C97.2 IC18.2(GND1_1) IC18.8(GND1_2) IC19.9(GND2_1) IC19.15(GND2_2) IC20.2(GND1_1) IC20.8(GND1_2) IC21.9(GND2_1) IC21.15(GND2_2)
GPI0_IN_Buff: IC20.3(VIA)
GPI1_IN_Buff: IC20.4(VIB)
GPI1_OUT_Buff: IC20.13(VOB)
GPI2_IN_Buff: IC20.5(VIC)
GPI2_OUT_Buff: IC20.12(VOC)
GPI3_IN_Buff: IC20.6(VID)
GPI3_OUT_Buff: IC20.11(VOD)
GPI4_IN_Buff: IC18.3(VIA)
GPI5_IN_Buff: IC18.4(VIB)
GPI5_OUT_Buff: IC18.13(VOB)
GPI6_IN_Buff: IC18.5(VIC)
GPI6_OUT_Buff: IC18.12(VOC)
GPI7_IN_Buff: IC18.6(VID)
GPI7_OUT_Buff: IC18.11(VOD)
GPO0_IN: IC19.3(VIA)
GPO0_OUT: IC19.14(VOA)
GPO1_IN: IC19.4(VIB)
GPO1_OUT: IC19.13(VOB)
GPO2_IN: IC19.5(VIC)
GPO2_OUT: IC19.12(VOC)
GPO3_IN: IC19.6(VID)
GPO3_OUT: IC19.11(VOD)
GPO4_IN: IC21.3(VIA)
GPO5_IN: IC21.4(VIB)
GPO5_OUT: IC21.13(VOB)
GPO6_IN: IC21.5(VIC)
GPO6_OUT: IC21.12(VOC)
GPO7_IN: IC21.6(VID)
GPO7_OUT: IC21.11(VOD)

Not connected (* = marked no-connect by the designer): IC18 7(NC) 10(VE2) 14(VOA)*; IC19 7(NC) 10(VE2); IC20 7(NC) 10(VE2) 14(VOA)*; IC21 7(NC) 10(VE2) 14(VOA)*

### Notes on the sheet
- INPUT
- Drawn
- Name
- Date
- Drawing Title
- Checked
- Drawing No.
- Approved
- Size
- A4
- Ver.
- Rev.
- Sheet
- Of

### Library data of the parts
C90-C97 = CAP_SMD_MLCC_2.2u50V_0603: as C34 on sheet MCU 1; ASSEMBLY: ASSEMBLY; PRICE: 1000= 27$; DESC: CAP, MLCC; VALUE: 100nF
IC18-IC21 = ADUM1400BRWZ-RL: Integrated Circuit; Manufacturer_Name: Analog Devices; Datasheet Link: https://www.analog.com/ADUM1400/datasheet; Height: 2.65mm; Manufacturer_Part_Number: ADUM1400BRWZ-RL; Mouser Part Number: 584-ADUM1400BRWZ-R; Mouser Price/Stock: https://www.mouser.co.uk/ProductDetail/Analog-Devices/ADUM1400BRWZ-RL?qs=WIvQP4zGanh%2FP3K3z%252BgM%252Bw%3D%3D; Arrow Part Number: ADUM1400BRWZ-RL; Arrow Price/Stock: https://www.arrow.com/en/products/adum1400brwz-rl/analog-devices?region=nac